# Altium project PrintingProjectAllDocs.PrjPCB (part 1 of 3)
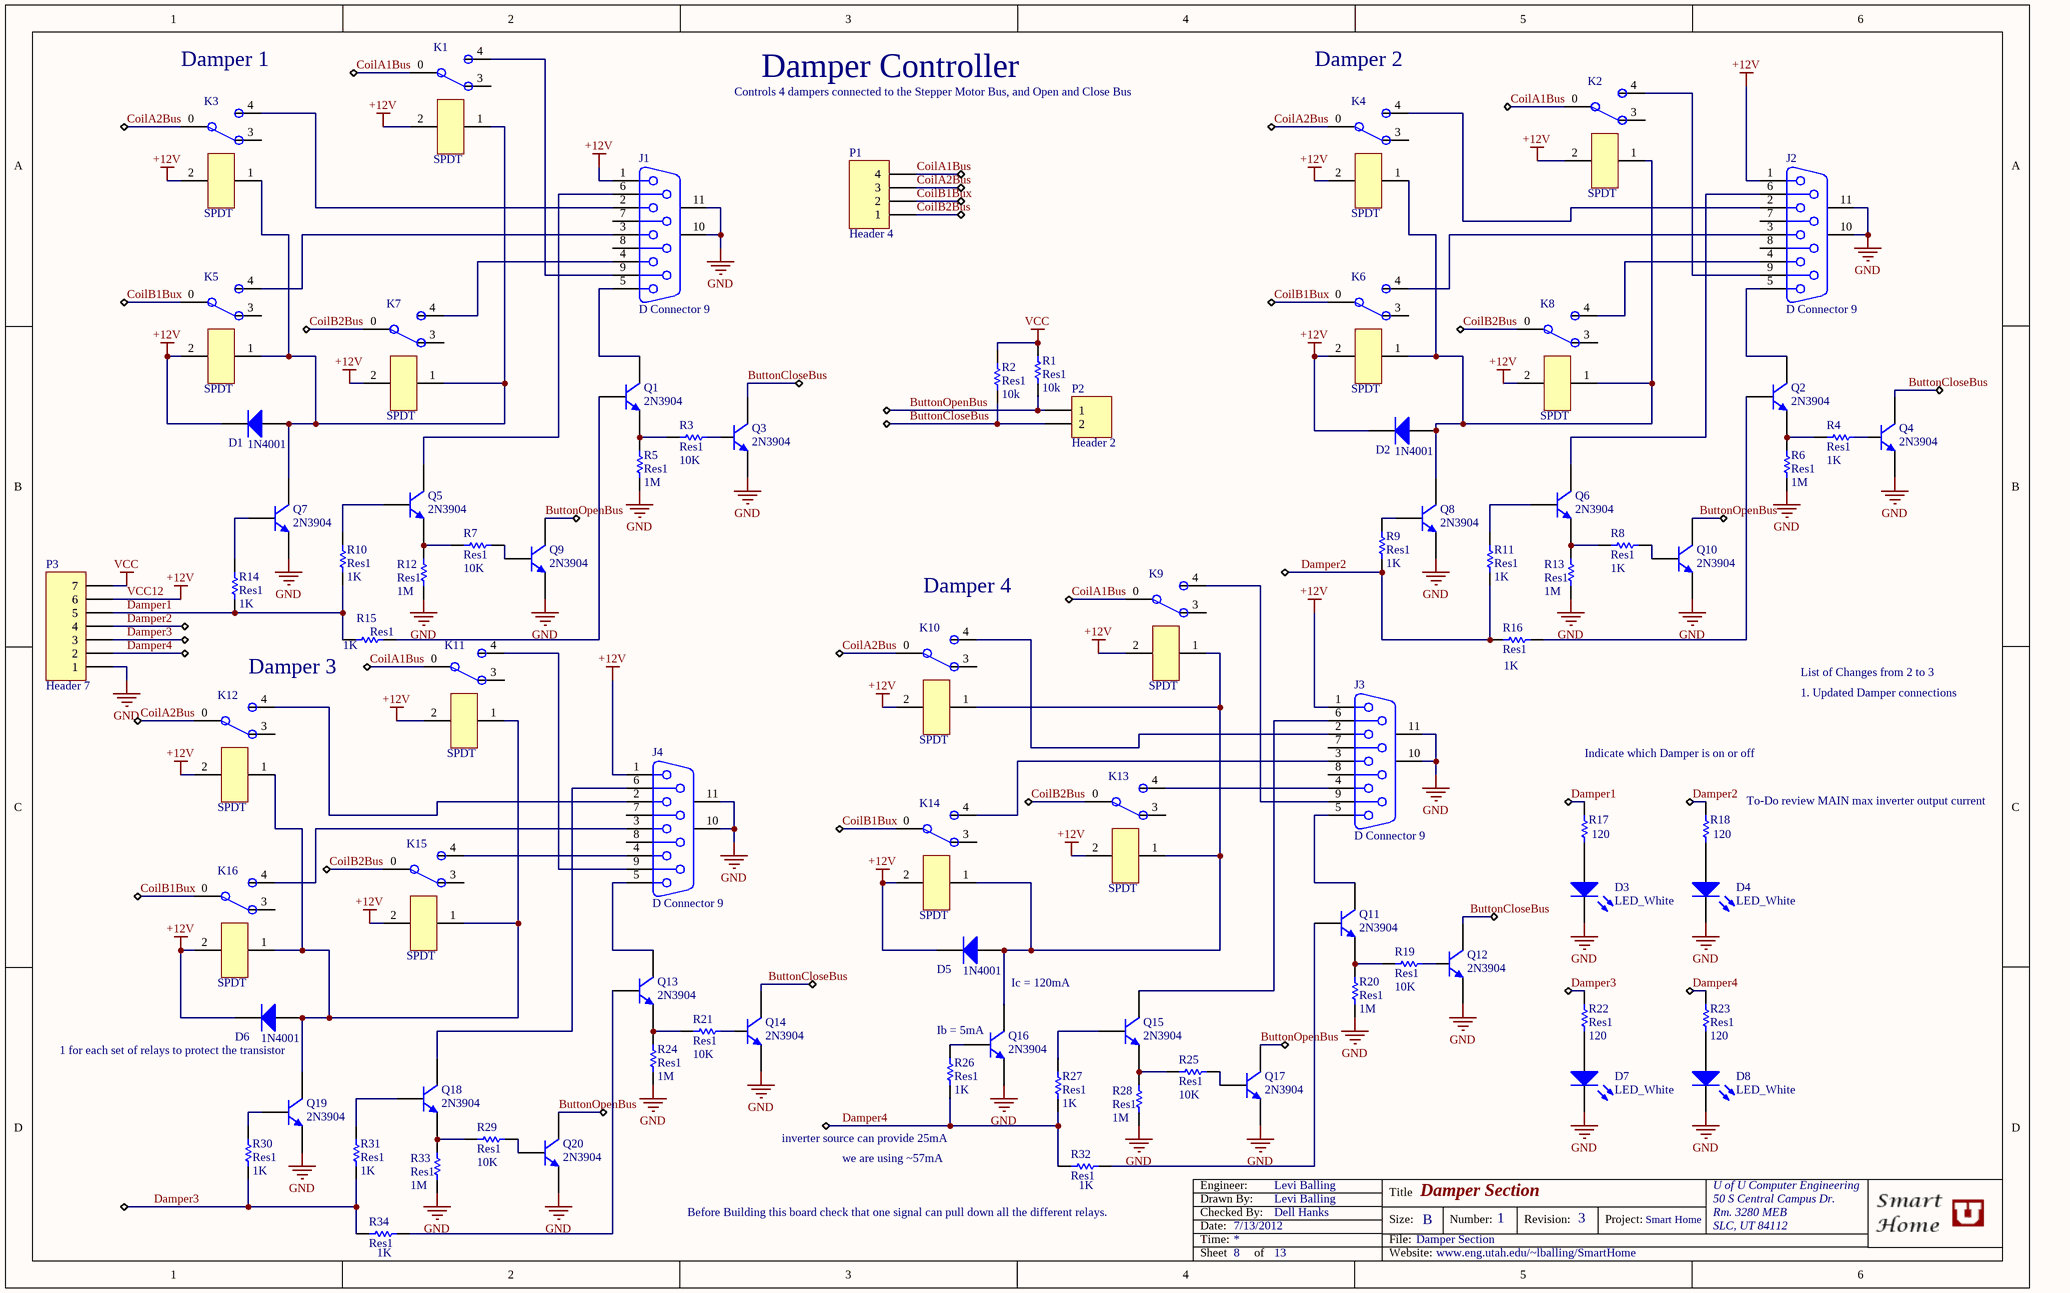
[diagram p0: DamperSection.SchDoc]
13 sheets, 669 parts. Net scope: global (net labels, ports and power ports of the same name join across sheets).
Board files: DamperSectionPCB.PcbDoc, HeatingAC_Garage.PcbDoc, HighPowerMotorController.PcbDoc, MainControllerPCB.PcbDoc, PowerBoard.PcbDoc, TemperatureSensorBlockPCB.PcbDoc, WirelessCommunications.PcbDoc, SpeakerMixerBoard.PcbDoc, SprinklerBoard.PcbDoc
Sheets:
  DamperSection.SchDoc
  EpicCubeDiagram.SchDoc
  EpicCubeDiagram2.SchDoc
  HeatingAC_Garage.SchDoc
  MainController.SchDoc
  MicMixer.SchDoc
  MotorController.SchDoc
  PowerAndFanBoard.SchDoc
  SpeakerMixer.SchDoc
  SprinklerBoard.SchDoc
  TemperatureSensorBlock.SchDoc
  TheEpicCube.SchDoc
  WirelessCommunications.SchDoc

## Sheet DamperSection.SchDoc: Damper Section
size B; Date: 7/13/2012; ApprovedBy: Levi Balling; CheckedBy: Dell Hanks; Author: Levi Balling; CompanyName: Smart Home; DrawnBy: Levi Balling; Engineer: Levi Balling; Organization: U of U Computer Engineering; Address1: 50 S Central Campus Dr.; Address2: Rm. 3280 MEB; Address3: SLC, UT 84112; DocumentNumber: 1; Revision: 3; SheetNumber: 8; SheetTotal: 13; Project: Smart Home; Website: www.eng.utah.edu/~lballing/SmartHome; CurrentDate: 7/13/2012; DocumentName: Damper Section; ProjectName: Smart Home

### Parts
(Parts that share a designator on the sheet are numbered #1, #2 ... from top to bottom, then left to right.)
D1#1  1N4001  [DO-41]
D2#1  1N4001  [DO-41]
D3#1  LED_White  [LED]
D4#1  LED_White  [LED]
D5#1  1N4001  [DO-41]
D6#1  1N4001  [DO-41]
D7#1  LED_White  [LED]
D8#1  LED_White  [LED]
J1#1  D Connector 9  [DSUB1.385-2H9]
J2#1  D Connector 9  [DSUB1.385-2H9]
J3#1  D Connector 9  [DSUB1.385-2H9]
J4#1  D Connector 9  [DSUB1.385-2H9]
K1#1  SPDT  [Relay - SPDT]
K2#1  SPDT  [Relay - SPDT]
K3#1  SPDT  [Relay - SPDT]
K4#1  SPDT  [Relay - SPDT]
K5#1  SPDT  [Relay - SPDT]
K6#1  SPDT  [Relay - SPDT]
K7#1  SPDT  [Relay - SPDT]
K8  SPDT  [Relay - SPDT]
K9  SPDT  [Relay - SPDT]
K10  SPDT  [Relay - SPDT]
K11  SPDT  [Relay - SPDT]
K12  SPDT  [Relay - SPDT]
K13  SPDT  [Relay - SPDT]
K14  SPDT  [Relay - SPDT]
K15  SPDT  [Relay - SPDT]
K16  SPDT  [Relay - SPDT]
P1#1  Header 4  [HDR1X4]
P2#1  Header 2  [HDR1X2]
P3#1  Header 7  [HDR1X7]
Q1#1  2N3904  [2N3904]
Q2#1  2N3904  [2N3904]
Q3#1  2N3904  [2N3904]
Q4#1  2N3904  [2N3904]
Q5#1  2N3904  [2N3904]
Q6#1  2N3904  [2N3904]
Q7#1  2N3904  [2N3904]
Q8#1  2N3904  [2N3904]
Q9#1  2N3904  [2N3904]
Q10#1  2N3904  [2N3904]
Q11  2N3904  [2N3904]
Q12  2N3904  [2N3904]
Q13  2N3904  [2N3904]
Q14  2N3904  [2N3904]
Q15  2N3904  [2N3904]
Q16  2N3904  [2N3904]
Q17  2N3904  [2N3904]
Q18  2N3904  [2N3904]
Q19  2N3904  [2N3904]
Q20  2N3904  [2N3904]
R1#1  Res1  value 10k  [AXIAL-0.3]
R2#1  Res1  value 10k  [AXIAL-0.3]
R3#1  Res1  value 10K  [AXIAL-0.3]
R4#1  Res1  value 1K  [AXIAL-0.3]
R5#1  Res1  value 1M  [AXIAL-0.3]
R6#1  Res1  value 1M  [AXIAL-0.3]
R7#1  Res1  value 10K  [AXIAL-0.3]
R8#1  Res1  value 1K  [AXIAL-0.3]
R9#1  Res1  value 1K  [AXIAL-0.3]
R10#1  Res1  value 1K  [AXIAL-0.3]
R11#1  Res1  value 1K  [AXIAL-0.3]
R12#1  Res1  value 1M  [AXIAL-0.3]
R13#1  Res1  value 1M  [AXIAL-0.3]
R14#1  Res1  value 1K  [AXIAL-0.3]
R15#1  Res1  value 1K  [AXIAL-0.3]
R16#1  Res1  value 1K  [AXIAL-0.3]
R17#1  value 120  [AXIAL-0.3]  (hidden comment: Res1)
R18#1  120  [AXIAL-0.3]
R19#1  Res1  value 10K  [AXIAL-0.3]
R20#1  Res1  value 1M  [AXIAL-0.3]
R21#1  Res1  value 10K  [AXIAL-0.3]
R22#1  Res1  value 120  [AXIAL-0.3]
R23#1  Res1  value 120  [AXIAL-0.3]
R24#1  Res1  value 1M  [AXIAL-0.3]
R25#1  Res1  value 10K  [AXIAL-0.3]
R26#1  Res1  value 1K  [AXIAL-0.3]
R27#1  Res1  value 1K  [AXIAL-0.3]
R28#1  Res1  value 1M  [AXIAL-0.3]
R29#1  Res1  value 10K  [AXIAL-0.3]
R30#1  Res1  value 1K  [AXIAL-0.3]
R31#1  Res1  value 1K  [AXIAL-0.3]
R32#1  Res1  value 1K  [AXIAL-0.3]
R33  Res1  value 1M  [AXIAL-0.3]
R34  Res1  value 1K  [AXIAL-0.3]

### Nets
GND: D3#1.2(K) D4#1.2(K) D7#1.2(K) D8#1.2(K) J1#1.10(MH1) J1#1.11(MH2) J2#1.10(MH1) J2#1.11(MH2) J3#1.10(MH1) J3#1.11(MH2) J4#1.10(MH1) J4#1.11(MH2) P3#1.1 Q3#1.1(E) Q4#1.1(E) Q7#1.1(E) Q8#1.1(E) Q9#1.1(E) Q10#1.1(E) Q12.1(E) Q14.1(E) Q16.1(E) Q17.1(E) Q19.1(E) Q20.1(E) R5#1.1 R6#1.1 R12#1.1 R13#1.1 R20#1.1 R24#1.1 R28#1.1 R33.1  [project net DampVCC12]
VCC: P3#1.7 R1#1.2 R2#1.2
VCC12: D1#1.2(K) D2#1.2(K) D5#1.2(K) D6#1.2(K) J1#1.1 J2#1.1 J3#1.1 J4#1.1 K1#1.2 K2#1.2 K3#1.2 K4#1.2 K5#1.2 K6#1.2 K7#1.2 K8.2 K9.2 K10.2 K11.2 K12.2 K13.2 K14.2 K15.2 K16.2 P3#1.6  [also labelled +12V]
ButtonCloseBus: P2#1.2 Q3#1.3(C) Q4#1.3(C) Q12.3(C) Q14.3(C) R2#1.1
ButtonOpenBus: P2#1.1 Q9#1.3(C) Q10#1.3(C) Q17.3(C) Q20.3(C) R1#1.1
CoilA1Bus: K1#1.0 K2#1.0 K9.0 K11.0 P1#1.4
CoilA2Bus: K3#1.0 K4#1.0 K10.0 K12.0 P1#1.3
CoilB1Bux: K5#1.0 K6#1.0 K14.0 K16.0 P1#1.2
CoilB2Bus: K7#1.0 K8.0 K13.0 K15.0 P1#1.1
Damper1: P3#1.5 R10#1.1 R14#1.1 R15#1.1 R17#1.1
Damper2: P3#1.4 R9#1.1 R11#1.1 R16#1.1 R18#1.1
Damper3: P3#1.3 R22#1.1 R30#1.1 R31#1.1 R34.1
Damper4: P3#1.2 R23#1.1 R26#1.1 R27#1.1 R32#1.1
NetD1#1_1: D1#1.1(A) K1#1.1 K3#1.1 K5#1.1 K7#1.1 Q7#1.3(C)
NetD2#1_1: D2#1.1(A) K2#1.1 K4#1.1 K6#1.1 K8.1 Q8#1.3(C)
NetD3#1_1: D3#1.1(A) R17#1.2
NetD4#1_1: D4#1.1(A) R18#1.2
NetD5#1_1: D5#1.1(A) K9.1 K10.1 K13.1 K14.1 Q16.3(C)
NetD6#1_1: D6#1.1(A) K11.1 K12.1 K15.1 K16.1 Q19.3(C)
NetD7#1_1: D7#1.1(A) R22#1.2
NetD8#1_1: D8#1.1(A) R23#1.2
NetJ1#1_2: J1#1.2 K3#1.4
NetJ1#1_3: J1#1.3 K5#1.4
NetJ1#1_4: J1#1.4 K7#1.4
NetJ1#1_5: J1#1.5 Q1#1.3(C)
NetJ1#1_6: J1#1.6 Q5#1.3(C)
NetJ1#1_9: J1#1.9 K1#1.4
NetJ2#1_2: J2#1.2 K4#1.4
NetJ2#1_3: J2#1.3 K6#1.4
NetJ2#1_4: J2#1.4 K8.4
NetJ2#1_5: J2#1.5 Q2#1.3(C)
NetJ2#1_6: J2#1.6 Q6#1.3(C)
NetJ2#1_9: J2#1.9 K2#1.4
NetJ3#1_2: J3#1.2 K10.4
NetJ3#1_3: J3#1.3 K14.4
NetJ3#1_4: J3#1.4 K13.4
NetJ3#1_5: J3#1.5 Q11.3(C)
NetJ3#1_6: J3#1.6 Q15.3(C)
NetJ3#1_9: J3#1.9 K9.4
NetJ4#1_2: J4#1.2 K12.4
NetJ4#1_3: J4#1.3 K16.4
NetJ4#1_4: J4#1.4 K15.4
NetJ4#1_5: J4#1.5 Q13.3(C)
NetJ4#1_6: J4#1.6 Q18.3(C)
NetJ4#1_9: J4#1.9 K11.4
NetQ1#1_1: Q1#1.1(E) R3#1.1 R5#1.2
NetQ1#1_2: Q1#1.2(B) R15#1.2
NetQ2#1_1: Q2#1.1(E) R4#1.1 R6#1.2
NetQ2#1_2: Q2#1.2(B) R16#1.2
NetQ3#1_2: Q3#1.2(B) R3#1.2
NetQ4#1_2: Q4#1.2(B) R4#1.2
NetQ5#1_1: Q5#1.1(E) R7#1.1 R12#1.2
NetQ5#1_2: Q5#1.2(B) R10#1.2
NetQ6#1_1: Q6#1.1(E) R8#1.1 R13#1.2
NetQ6#1_2: Q6#1.2(B) R11#1.2
NetQ7#1_2: Q7#1.2(B) R14#1.2
NetQ8#1_2: Q8#1.2(B) R9#1.2
NetQ9#1_2: Q9#1.2(B) R7#1.2
NetQ10#1_2: Q10#1.2(B) R8#1.2
NetQ11_1: Q11.1(E) R19#1.1 R20#1.2
NetQ11_2: Q11.2(B) R32#1.2
NetQ12_2: Q12.2(B) R19#1.2
NetQ13_1: Q13.1(E) R21#1.1 R24#1.2
NetQ13_2: Q13.2(B) R34.2
NetQ14_2: Q14.2(B) R21#1.2
NetQ15_1: Q15.1(E) R25#1.1 R28#1.2
NetQ15_2: Q15.2(B) R27#1.2
NetQ16_2: Q16.2(B) R26#1.2
NetQ17_2: Q17.2(B) R25#1.2
NetQ18_1: Q18.1(E) R29#1.1 R33.2
NetQ18_2: Q18.2(B) R31#1.2
NetQ19_2: Q19.2(B) R30#1.2
NetQ20_2: Q20.2(B) R29#1.2

Not connected (* = marked no-connect by the designer): J1#1 7 8; J2#1 7 8; J3#1 7 8; J4#1 7 8; K1#1 3; K2#1 3; K3#1 3; K4#1 3; K5#1 3; K6#1 3; K7#1 3; K8 3; K9 3; K10 3; K11 3; K12 3; K13 3; K14 3; K15 3; K16 3

### Notes on the sheet
- (near K3#1) Damper 1
- Controls 4 dampers connected to the Stepper Motor Bus, and Open and Close Bus
- Damper Controller
- (near K4#1) Damper 2
- (near K10) Damper 4
- Damper 3
- List of Changes from 2 to 3
- 1. Updated Damper connections
- Indicate which Damper is on or off
- (near R18#1) To-Do review MAIN max inverter output current
- (near Q16) Ib = 5mA
- Ic = 120mA
- 1 for each set of relays to protect the transistor
- (near R26#1) inverter source can provide 25mA
- we are using ~57mA
- (near R32#1) Before Building this board check that one signal can pull down all the different relays.
- Date:
- Time:
- Engineer:
- Drawn By:
- Checked By:
- Title
- Size:
- File:
- B
- Number:
- Revision:
- Project:
- Sheet
- of
- Website:

### Library data of the parts
D1#1 D2#1 D5#1 D6#1 = 1N4001: 1.0 Ampere General Purpose Rectifier; Vendor: Taydaelectronics; Published: 8-Jun-2000; LatestRevisionDate: 17-Jul-2002; LatestRevisionNote: Re-released for DXP Platform.; DatasheetDocument: 1998; PackageDocument: Aug-1999; PackageReference: DO-41; Publisher: Altium Limited; Code_JEDEC: DO-204-AL; ComponentLink1Description: Manufacturer Link; ComponentLink1URL: http://www.fairchildsemi.com/; ComponentLink2Description: Pinout Specification; ComponentLink2URL: http://www.fairchildsemi.com/ds/1N%2F1N4001.pdf; Price: 0.01; Value: 1N4001
D3#1 D4#1 D7#1 D8#1 = LED0: Typical INFRARED GaAs LED; Vendor: Taydaelectronics; Value: White_LED; Published: 8-Jun-2000; LatestRevisionDate: 08-Jul-2005; LatestRevisionNote: Mech Layer 1 removed.; PackageReference: LED-0; Publisher: Altium Limited; PackageDescription: LED; 2 Leads; Price: 0.04
J1#1 J2#1 J3#1 J4#1 = D Connector 9: Receptacle Assembly, 9 Position, Right Angle; PackageDocument: O; Positions: 9; Vendor: Taydaelectronics; Published: 15-Jun-2001; LatestRevisionDate: 17-Jul-2002; LatestRevisionNote: Re-released for DXP Platform.; DatasheetDocument: 1-Sep-1999; PackageReference: 788750; Publisher: Altium Limited; Orientation: Right Angle; Gender: Receptacle; Price: 0.48; Value: D Connector 9
K1#1 K2#1 K3#1 K4#1 K5#1 K6#1 K7#1 K8-K16 = SPDT: Vendor: Taydaelectronics; Coil Resistance: 400; Price: 0.64
P1#1 = Header 4: Header, 4-Pin; Vendor: Taydaelectronics; LatestRevisionDate: 17-Jul-2002; LatestRevisionNote: Re-released for DXP Platform.; Publisher: Altium Limited; Price: 0.04; Value: Header 4
P2#1 = Header 2: Header, 2-Pin; Vendor: Taydaelectronics; LatestRevisionDate: 17-Jul-2002; LatestRevisionNote: Re-released for DXP Platform.; Publisher: Altium Limited; Price: 0.02; Value: Header 2
P3#1 = Header 7: Header, 7-Pin; Vendor: Taydaelectronics; LatestRevisionDate: 17-Jul-2002; LatestRevisionNote: Re-released for DXP Platform.; Publisher: Altium Limited; Price: 0.07; Value: Header 7
Q1#1 Q2#1 Q3#1 Q4#1 Q5#1 Q6#1 Q7#1 Q8#1 Q9#1 Q10#1 Q11-Q20 = 2N3904: NPN General Purpose Amplifier; Vendor: Taydaelectronics; Published: 8-Jun-2000; LatestRevisionDate: 15-Jan-2003; LatestRevisionNote: PCB Footprint 'BCY-W3/D4.7' replaced; DatasheetVersion: 1997; PackageVersion: Sep-1998; PackageReference: TO-92A; Publisher: Altium Limited; PackageDescription: TO, Flat Index; 3 In-Line, Axial Leads; Body Dia. 4.5mm; Leads 0.51 x 0.48 mm (max); ComponentLink1URL: http://www.fairchildsemi.com/; ComponentLink2Description: Datasheet; ComponentLink2URL: http://www.fairchildsemi.com/ds/2N%2F2N3904.pdf; Price: 0.01; Value: 2N3904
R1#1 R2#1 R3#1 R4#1 R5#1 R6#1 R7#1 R8#1 R9#1 R10#1 R11#1 R12#1 R13#1 R14#1 R15#1 R16#1 R17#1 R18#1 R19#1 R20#1 R21#1 R22#1 R23#1 R24#1 R25#1 R26#1 R27#1 R28#1 R29#1 R30#1 R31#1 R32#1 R33 R34 = Res1: Resistor; Vendor: Taydaelectronics; Published: 8-Jun-2000; LatestRevisionDate: 17-Jul-2002; LatestRevisionNote: Re-released for DXP Platform.; PackageReference: AXIAL-0.3; Publisher: Altium Limited; PackageDescription: Axial Device, Thru-Hole; 2 Leads; 0.3 in Pin Spacing; Price: 0.01
  R18#1: Value: 120

## Sheet EpicCubeDiagram.SchDoc: Epic Cube Diagram
size B; CompanyName: Smart Home; DrawnBy: Levi Balling; Engineer: Levi Balling; Organization: U of U Computer Engineering; Address1: 50 S Central Campus Dr.; Address2: Rm. 3280 MEB; Address3: SLC, UT 84112; DocumentNumber: 1; Revision: 1; SheetNumber: 2; SheetTotal: 13; Project: Smart Home; Website: www.eng.utah.edu/~lballing/SmartHome
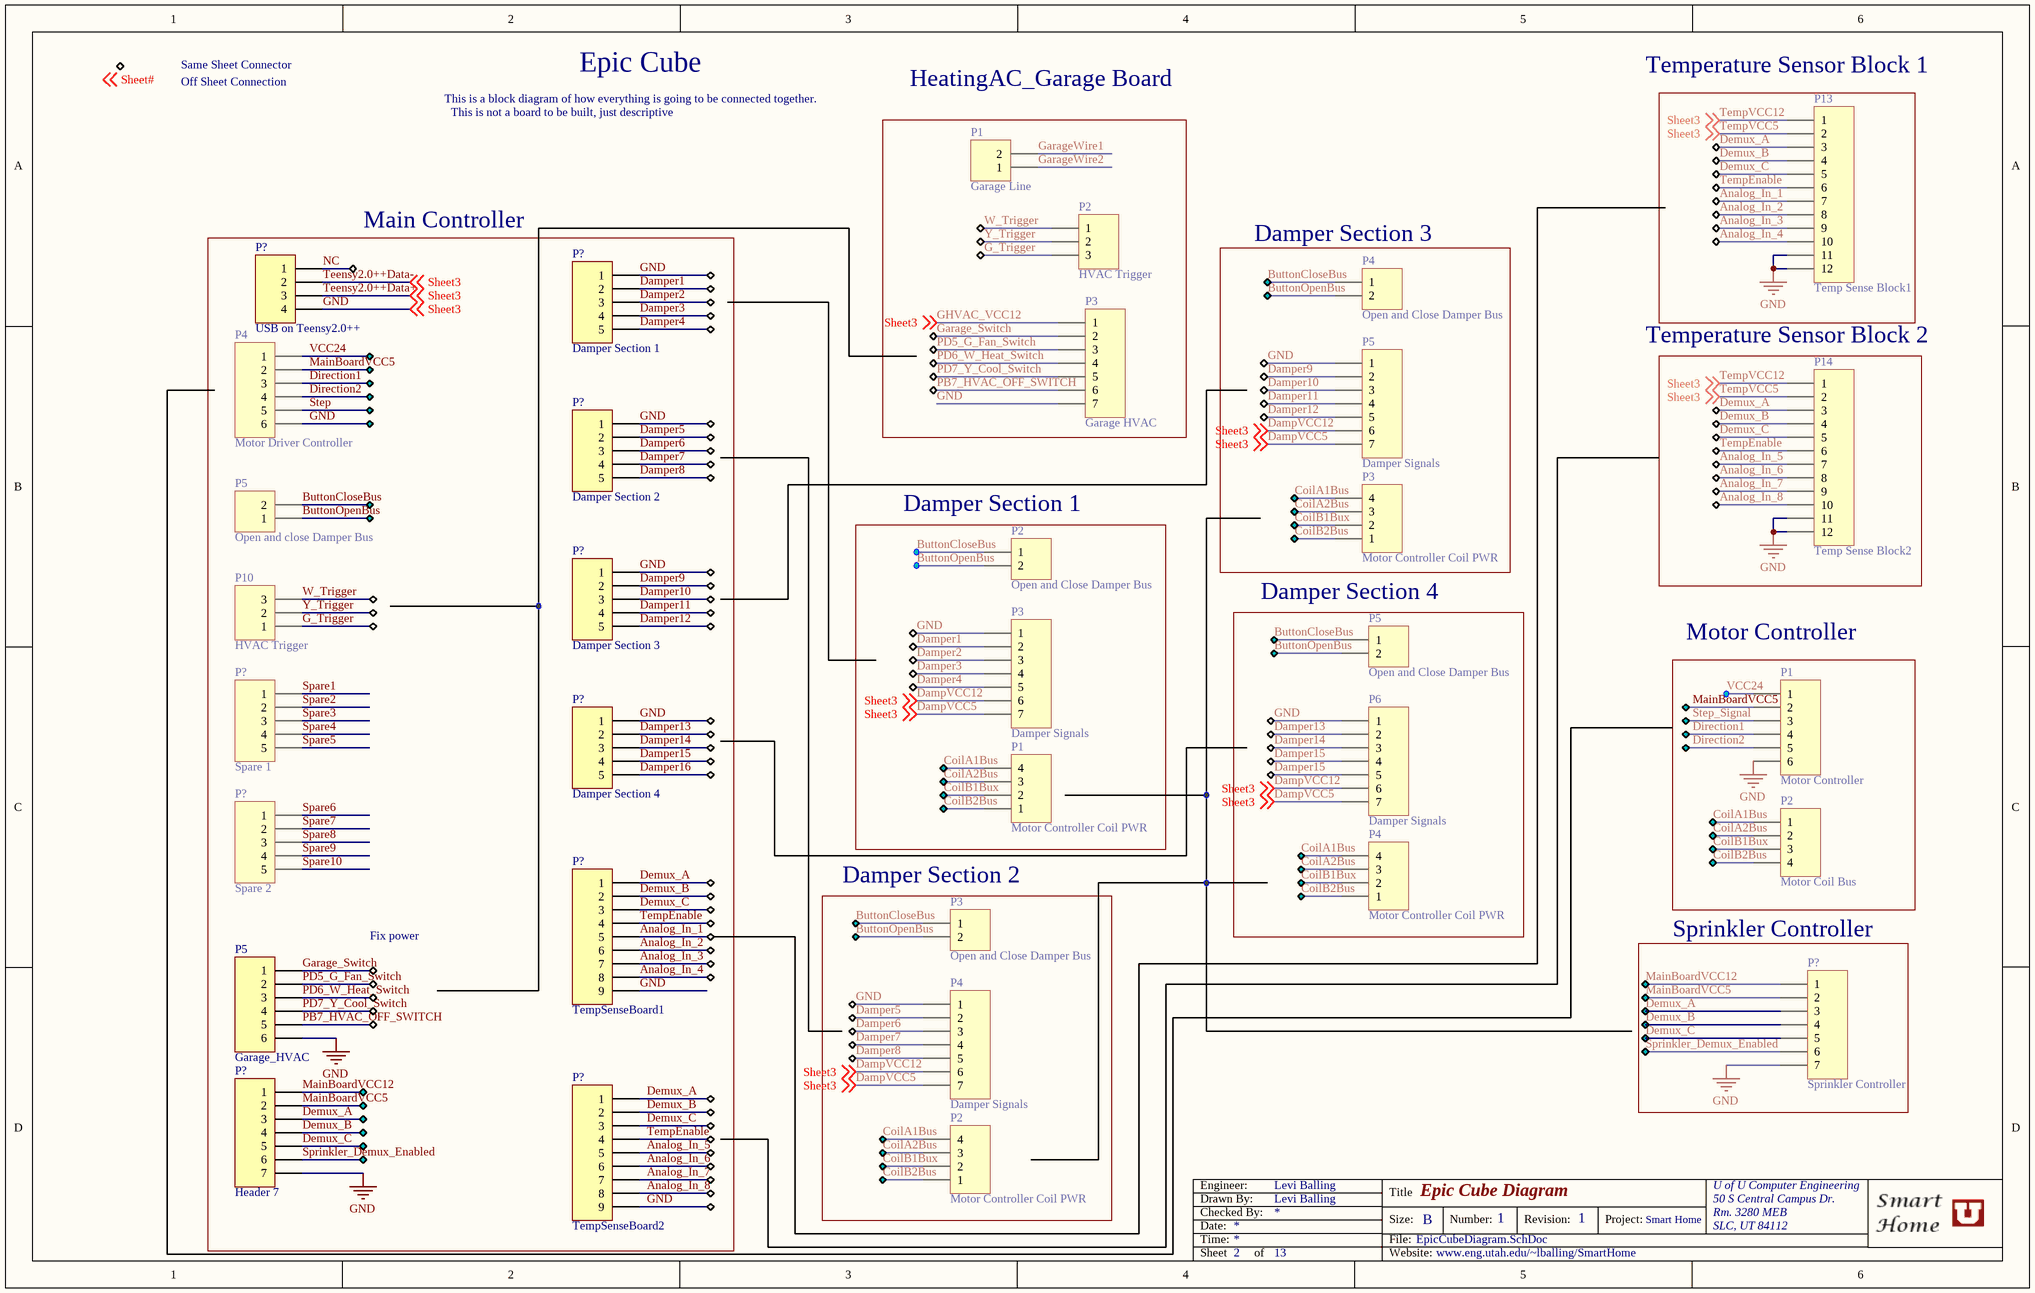
[diagram p1: EpicCubeDiagram.SchDoc]

### Parts
(Parts that share a designator on the sheet are numbered #1, #2 ... from top to bottom, then left to right.)
P1#2  Garage Line  [HDR1X2]
P1#3  Motor Controller  [HDR1X6]
P1#4  Motor Controller Coil PWR  [HDR1X4]
P2#2  HVAC Trigger  [HDR1X3]
P2#3  Open and Close Damper Bus  [HDR1X2]
P2#4  Motor Coil Bus  [HDR1X4]
P2#5  Motor Controller Coil PWR  [HDR1X4]
P3#2  Garage HVAC  [HDR1X7]
P3#3  Motor Controller Coil PWR  [HDR1X4]
P3#4  Damper Signals  [HDR1X7]
P3#5  Open and Close Damper Bus  [HDR1X2]
P4#1  Open and Close Damper Bus  [HDR1X2]
P4#2  Motor Driver Controller  [HDR1X6]
P4#3  Motor Controller Coil PWR  [HDR1X4]
P4#4  Damper Signals  [HDR1X7]
P5#1  Damper Signals  [HDR1X7]
P5#2  Open and close Damper Bus  [HDR1X2]
P5#3  Open and Close Damper Bus  [HDR1X2]
P5#4  Garage_HVAC  [HDR1X6]
P6#1  Damper Signals  [HDR1X7]
P10#1  HVAC Trigger  [HDR1X3]
P13#1  Temp Sense Block1  [HDR1X12]
P14#1  Temp Sense Block2  [HDR1X12]
P?#1  USB on Teensy2.0++  [HDR1X4]
P?#2  Damper Section 1  [HDR1X5]
P?#3  Damper Section 2  [HDR1X5]
P?#4  Damper Section 3  [HDR1X5]
P?#5  Spare 1  [HDR1X5]
P?#6  Damper Section 4  [HDR1X5]
P?#7  Spare 2  [HDR1X5]
P?#8  TempSenseBoard1  [HDR1X9]
P?#9  Sprinkler Controller  [HDR1X7]
P?#10  Header 7  [HDR1X7]
P?#11  TempSenseBoard2  [HDR1X9]

### Blocks framed on the sheet
Main Controller: P4#2 P5#2 P5#4 P10#1 P?#1-P?#8 P?#10 P?#11
Damper Section 3: P3#3 P4#1 P5#1
Damper Section 1: P1#4 P2#3 P3#4
Damper Section 4: P4#3 P5#3 P6#1
Motor Controller: P1#3 P2#4
Damper Section 2: P2#5 P3#5 P4#4
Sprinkler Controller: P?#9

### Nets
DampVCC12: P1#3.6 P3#2.1 P3#2.7 P3#4.1 P3#4.6 P3#4.7 P4#2.6 P4#4.1 P4#4.6 P4#4.7 P5#1.1 P5#1.6 P5#1.7 P5#4.6 P6#1.1 P6#1.6 P6#1.7 P13#1.1 P13#1.2 P13#1.11 P13#1.12 P14#1.1 P14#1.2 P14#1.11 P14#1.12 P?#1.2 P?#1.3 P?#1.4 P?#2.1 P?#3.1 P?#4.1 P?#6.1 P?#8.9 P?#9.7 P?#10.7 P?#11.9 ; off-sheet Sheet3  [also labelled DampVCC5, GHVAC_VCC12, GND, Sheet3, Teensy2.0++Data+, Teensy2.0++Data-, TempVCC12, TempVCC5]
Analog_In_1: P13#1.7 P?#8.5
Analog_In_2: P13#1.8 P?#8.6
Analog_In_3: P13#1.9 P?#8.7
Analog_In_4: P13#1.10 P?#8.8
Analog_In_5: P14#1.7 P?#11.5
Analog_In_6: P14#1.8 P?#11.6
Analog_In_7: P14#1.9 P?#11.7
Analog_In_8: P14#1.10 P?#11.8
ButtonCloseBus: P2#3.1 P3#5.1 P4#1.1 P5#2.2 P5#3.1
ButtonOpenBus: P2#3.2 P3#5.2 P4#1.2 P5#2.1 P5#3.2
CoilA1Bus: P1#4.4 P2#4.1 P2#5.4 P3#3.4 P4#3.4
CoilA2Bus: P1#4.3 P2#4.2 P2#5.3 P3#3.3 P4#3.3
CoilB1Bux: P1#4.2 P2#4.3 P2#5.2 P3#3.2 P4#3.2
CoilB2Bus: P1#4.1 P2#4.4 P2#5.1 P3#3.1 P4#3.1
Damper1: P3#4.2 P?#2.2
Damper2: P3#4.3 P?#2.3
Damper3: P3#4.4 P?#2.4
Damper4: P3#4.5 P?#2.5
Damper5: P4#4.2 P?#3.2
Damper6: P4#4.3 P?#3.3
Damper7: P4#4.4 P?#3.4
Damper8: P4#4.5 P?#3.5
Damper9: P5#1.2 P?#4.2
Damper10: P5#1.3 P?#4.3
Damper11: P5#1.4 P?#4.4
Damper12: P5#1.5 P?#4.5
Damper13: P6#1.2 P?#6.2
Damper14: P6#1.3 P?#6.3
Damper15: P6#1.4 P6#1.5 P?#6.4
Damper16: P?#6.5
Demux_A: P13#1.3 P14#1.3 P?#8.1 P?#9.3 P?#10.3 P?#11.1
Demux_B: P13#1.4 P14#1.4 P?#8.2 P?#9.4 P?#10.4 P?#11.2
Demux_C: P13#1.5 P14#1.5 P?#8.3 P?#9.5 P?#10.5 P?#11.3
Direction1: P1#3.4 P4#2.3
Direction2: P1#3.5 P4#2.4
G_Trigger: P2#2.3 P10#1.1
Garage_Switch: P3#2.2 P5#4.1
GarageWire1: P1#2.2
GarageWire2: P1#2.1
MainBoardVCC5: P1#3.2 P4#2.2 P?#9.2 P?#10.2
MainBoardVCC12: P?#9.1 P?#10.1
NC: P?#1.1
PB7_HVAC_OFF_SWITCH: P3#2.6 P5#4.5
PD5_G_Fan_Switch: P3#2.3 P5#4.2
PD6_W_Heat_Switch: P3#2.4 P5#4.3
PD7_Y_Cool_Switch: P3#2.5 P5#4.4
Spare1: P?#5.1
Spare2: P?#5.2
Spare3: P?#5.3
Spare4: P?#5.4
Spare5: P?#5.5
Spare6: P?#7.1
Spare7: P?#7.2
Spare8: P?#7.3
Spare9: P?#7.4
Spare10: P?#7.5
Sprinkler_Demux_Enabled: P?#9.6 P?#10.6
Step: P4#2.5
Step_Signal: P1#3.3
TempEnable: P13#1.6 P14#1.6 P?#8.4 P?#11.4
VCC24: P1#3.1 P4#2.1
W_Trigger: P2#2.1 P10#1.3
Y_Trigger: P2#2.2 P10#1.2

### Notes on the sheet
- Same Sheet Connector
- Off Sheet Connection
- This is a block diagram of how everything is going to be connected together.
- Epic Cube
- HeatingAC_Garage Board
- (near P13#1) Temperature Sensor Block 1
- This is not a board to be built, just descriptive
- Temperature Sensor Block 2
- Fix power
- Labels drawn without touching a wire or pin: Sheet#
- Date:
- Time:
- Engineer:
- Drawn By:
- Checked By:
- Title
- Size:
- File:
- B
- Number:
- Revision:
- Project:
- Sheet
- of
- Website:

### Library data of the parts
P1#2 P2#3 P3#5 P4#1 P5#2 P5#3 = Header 2: Header, 2-Pin; Vendor: Taydaelectronics; LatestRevisionDate: 17-Jul-2002; LatestRevisionNote: Re-released for DXP Platform.; Publisher: Altium Limited; Price: 0.02; Value: Header 2
P1#3 P4#2 P5#4 = Header 6: Header, 6-Pin; Vendor: Taydaelectronics; LatestRevisionDate: 17-Jul-2002; LatestRevisionNote: Re-released for DXP Platform.; Publisher: Altium Limited; Price: 0.06; Value: Header 6
P1#4 P2#4 P2#5 P3#3 P4#3 P?#1 = Header 4: Header, 4-Pin; Vendor: Taydaelectronics; LatestRevisionDate: 17-Jul-2002; LatestRevisionNote: Re-released for DXP Platform.; Publisher: Altium Limited; Price: 0.04; Value: Header 4
P2#2 = Header 3: Header, 3-Pin; Vendor: Taydaelectronics; LatestRevisionDate: 17-Jul-2002; LatestRevisionNote: Re-released for DXP Platform.; Publisher: Altium Limited; Price: 0.03; Value: Header 3
P3#2 P3#4 P4#4 P5#1 P6#1 P?#9 P?#10 = Header 7: Header, 7-Pin; Vendor: Taydaelectronics; LatestRevisionDate: 17-Jul-2002; LatestRevisionNote: Re-released for DXP Platform.; Publisher: Altium Limited; Price: 0.07; Value: Header 7
P10#1 = Header 3: Header, 3-Pin; Vendor: Taydaelectronics; Value: Header 2; LatestRevisionDate: 17-Jul-2002; LatestRevisionNote: Re-released for DXP Platform.; Publisher: Altium Limited; Price: 0.03
P13#1 P14#1 = Header 12: Header, 12-Pin; Vendor: Taydaelectronics; LatestRevisionDate: 17-Jul-2002; LatestRevisionNote: Re-released for DXP Platform.; Publisher: Altium Limited; Price: 0.12; Value: Header 12
P?#2-P?#7 = Header 5: Header, 5-Pin; Vendor: Taydaelectronics; LatestRevisionDate: 17-Jul-2002; LatestRevisionNote: Re-released for DXP Platform.; Publisher: Altium Limited; Price: 0.05; Value: Header 5
P?#8 P?#11 = Header 9: Header, 9-Pin; Vendor: Taydaelectronics; LatestRevisionDate: 17-Jul-2002; LatestRevisionNote: Re-released for DXP Platform.; Publisher: Altium Limited; Price: 0.09; Value: Header 9

## Sheet EpicCubeDiagram2.SchDoc: Epic Cube Diagram
size B; CompanyName: Smart Home; DrawnBy: Levi Balling; Engineer: Levi Balling; Organization: U of U Computer Engineering; Address1: 50 S Central Campus Dr.; Address2: Rm. 3280 MEB; Address3: SLC, UT 84112; DocumentNumber: 1; Revision: 1; SheetNumber: 3; SheetTotal: 13; Project: Smart Home; Website: www.eng.utah.edu/~lballing/SmartHome
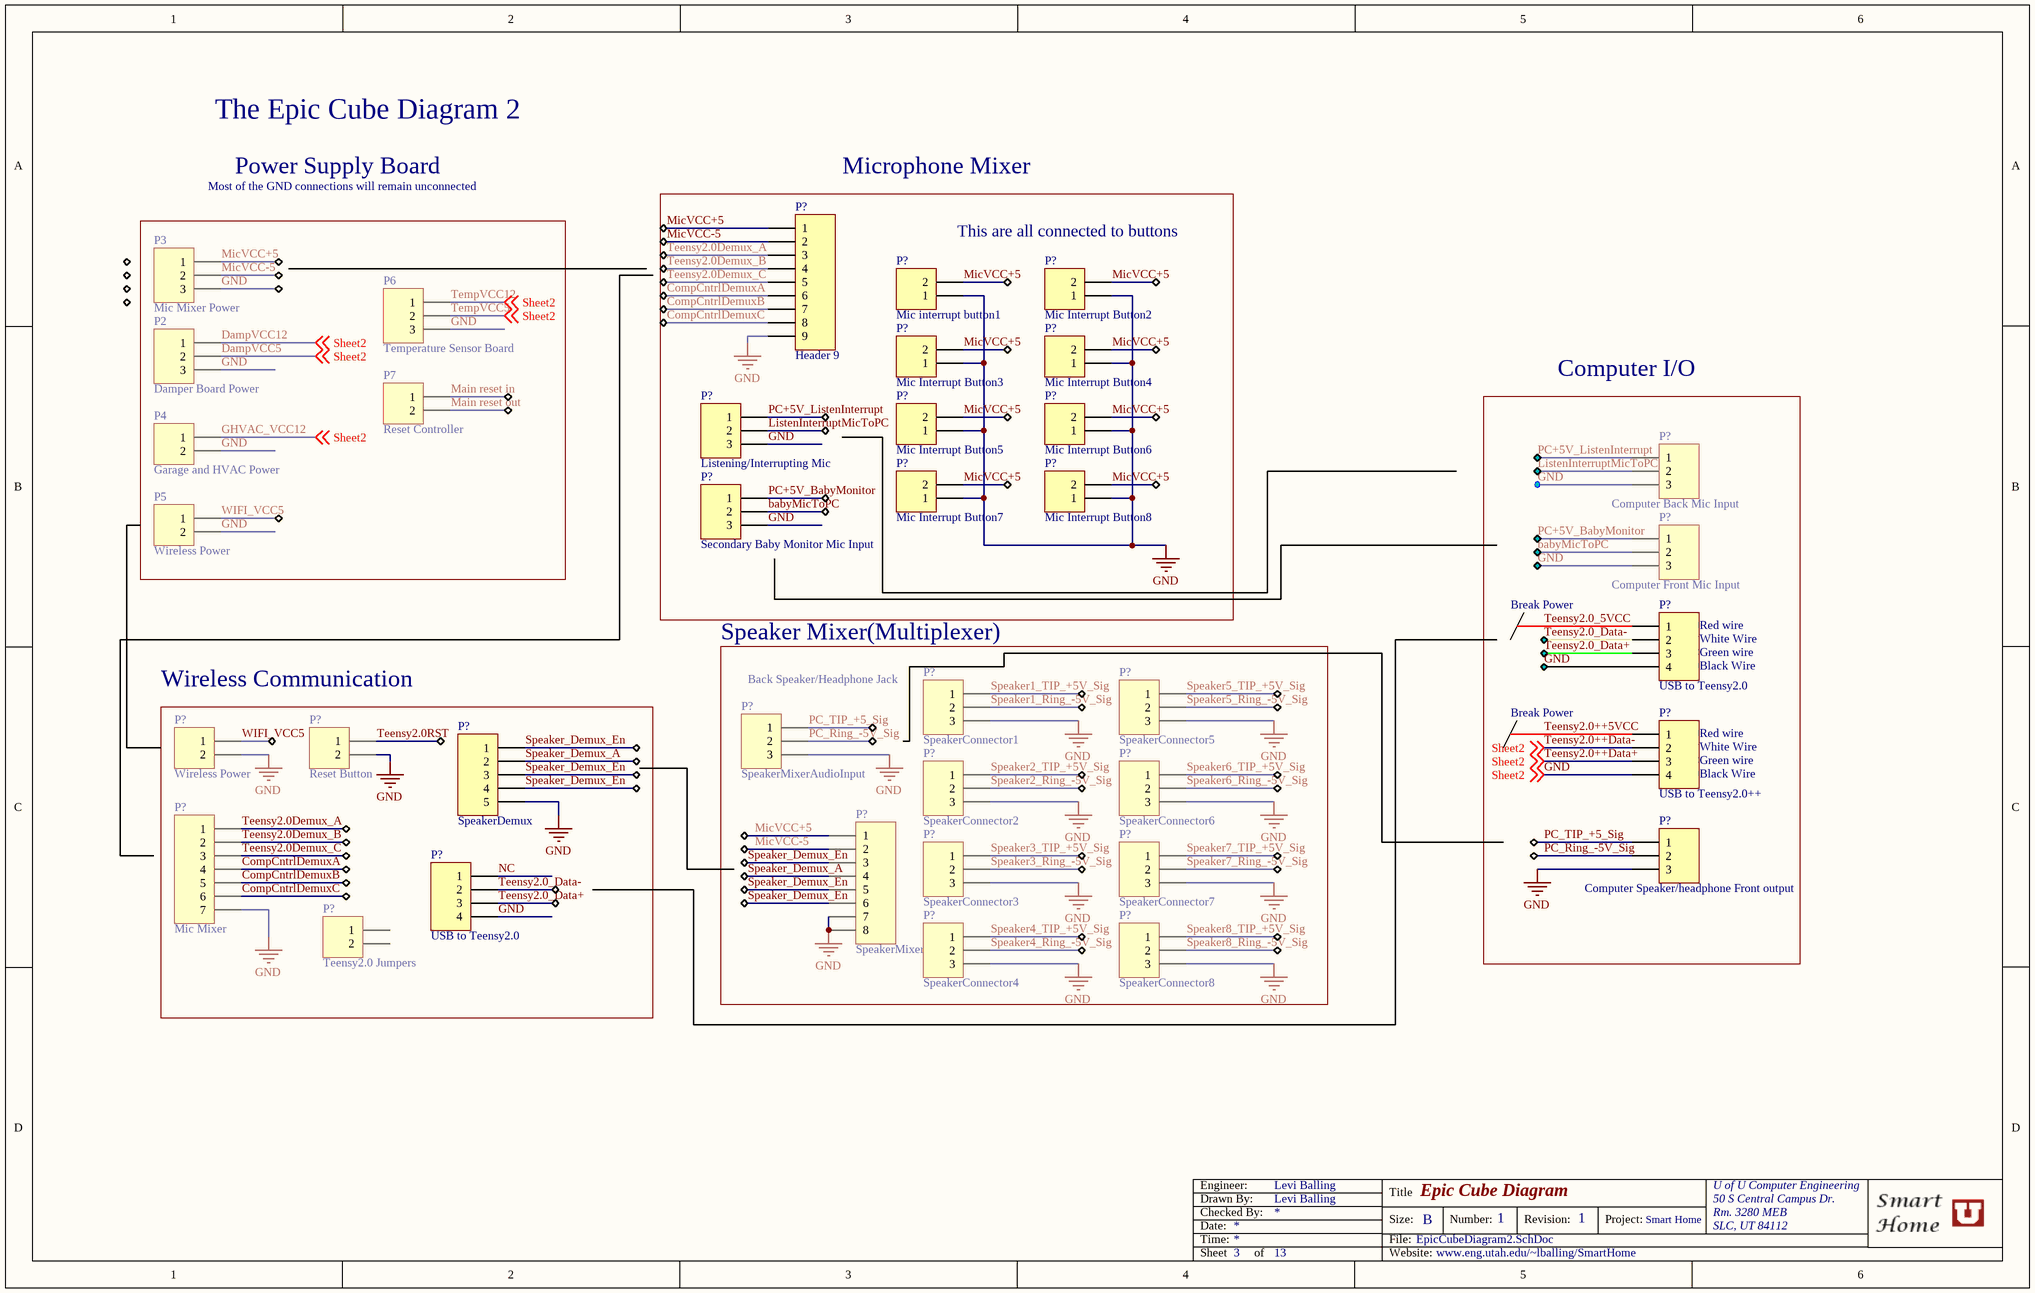
[diagram p2: EpicCubeDiagram2.SchDoc]

### Parts
(Parts that share a designator on the sheet are numbered #1, #2 ... from top to bottom, then left to right.)
P2#6  Damper Board Power  [HDR1X3]
P3#6  Mic Mixer Power  [HDR1X3]
P4#5  Garage and HVAC Power  [HDR1X2]
P5#5  Wireless Power  [HDR1X2]
P6#2  Temperature Sensor Board  [HDR1X3]
P7#1  Reset Controller  [HDR1X2]
P?#12  Header 9  [HDR1X9]
P?#13  Mic interrupt button1  [HDR1X2]
P?#14  Mic Interrupt Button2  [HDR1X2]
P?#15  Mic Interrupt Button3  [HDR1X2]
P?#16  Mic Interrupt Button4  [HDR1X2]
P?#17  Listening/Interrupting Mic  [HDR1X3]
P?#18  Mic Interrupt Button5  [HDR1X2]
P?#19  Mic Interrupt Button6  [HDR1X2]
P?#20  Computer Back Mic Input  [HDR1X3]
P?#21  Secondary Baby Monitor Mic Input  [HDR1X3]
P?#22  Mic Interrupt Button7  [HDR1X2]
P?#23  Mic Interrupt Button8  [HDR1X2]
P?#24  Computer Front Mic Input  [HDR1X3]
P?#25  USB to Teensy2.0  [HDR1X4]
P?#26  SpeakerConnector1  [HDR1X3]
P?#27  SpeakerConnector5  [HDR1X3]
P?#28  SpeakerMixerAudioInput  [HDR1X3]
P?#29  USB to Teensy2.0++  [HDR1X4]
P?#30  Wireless Power  [HDR1X2]
P?#31  Reset Button  [HDR1X2]
P?#32  SpeakerDemux  [HDR1X5]
P?#33  SpeakerConnector2  [HDR1X3]
P?#34  SpeakerConnector6  [HDR1X3]
P?#35  Mic Mixer  [HDR1X7]
P?#36  SpeakerMixer  [HDR1X8]
P?#37  Computer Speaker/headphone Front output  [HDR1X3]
P?#38  SpeakerConnector3  [HDR1X3]
P?#39  SpeakerConnector7  [HDR1X3]
P?#40  USB to Teensy2.0  [HDR1X4]
P?#41  Teensy2.0 Jumpers  [HDR1X2]
P?#42  SpeakerConnector4  [HDR1X3]
P?#43  SpeakerConnector8  [HDR1X3]

### Blocks framed on the sheet
Microphone Mixer: P?#12-P?#19 P?#21-P?#23
Computer I/O: P?#20 P?#24 P?#25 P?#29 P?#37
Speaker Mixer(Multiplexer): P?#26-P?#28 P?#33 P?#34 P?#36 P?#38 P?#39 P?#42 P?#43
Wireless Communication: P?#30-P?#32 P?#35 P?#40 P?#41

### Nets
DampVCC12: P2#6.1 P2#6.2 P2#6.3 P3#6.3 P4#5.1 P4#5.2 P5#5.2 P6#2.1 P6#2.2 P6#2.3 P?#12.9 P?#13.1 P?#14.1 P?#15.1 P?#16.1 P?#17.3 P?#18.1 P?#19.1 P?#20.3 P?#21.3 P?#22.1 P?#23.1 P?#24.3 P?#25.4 P?#26.3 P?#27.3 P?#28.3 P?#29.2 P?#29.3 P?#29.4 P?#30.2 P?#31.2 P?#32.5 P?#33.3 P?#34.3 P?#35.7 P?#36.7 P?#36.8 P?#37.3 P?#38.3 P?#39.3 P?#40.4 P?#42.3 P?#43.3 ; off-sheet Sheet2  [also labelled DampVCC5, GHVAC_VCC12, GND, Sheet2, Teensy2.0++Data+, Teensy2.0++Data-, TempVCC12, TempVCC5]
babyMicToPC: P?#21.2 P?#24.2
CompCntrlDemuxA: P?#12.6 P?#35.4
CompCntrlDemuxB: P?#12.7 P?#35.5
CompCntrlDemuxC: P?#12.8 P?#35.6
ListenInterruptMicToPC: P?#17.2 P?#20.2
Main reset in: P7#1.1
Main reset out: P7#1.2
MicVCC+5: P3#6.1 P?#12.1 P?#13.2 P?#14.2 P?#15.2 P?#16.2 P?#18.2 P?#19.2 P?#22.2 P?#23.2 P?#36.1
MicVCC-5: P3#6.2 P?#12.2 P?#36.2
NC: P?#40.1
PC+5V_BabyMonitor: P?#21.1 P?#24.1
PC+5V_ListenInterrupt: P?#17.1 P?#20.1
PC_Ring_-5V_Sig: P?#28.2 P?#37.2
PC_TIP_+5_Sig: P?#28.1 P?#37.1
Speaker1_Ring_-5V_Sig: P?#26.2
Speaker1_TIP_+5V_Sig: P?#26.1
Speaker2_Ring_-5V_Sig: P?#33.2
Speaker2_TIP_+5V_Sig: P?#33.1
Speaker3_Ring_-5V_Sig: P?#38.2
Speaker3_TIP_+5V_Sig: P?#38.1
Speaker4_Ring_-5V_Sig: P?#42.2
Speaker4_TIP_+5V_Sig: P?#42.1
Speaker5_Ring_-5V_Sig: P?#27.2
Speaker5_TIP_+5V_Sig: P?#27.1
Speaker6_Ring_-5V_Sig: P?#34.2
Speaker6_TIP_+5V_Sig: P?#34.1
Speaker7_Ring_-5V_Sig: P?#39.2
Speaker7_TIP_+5V_Sig: P?#39.1
Speaker8_Ring_-5V_Sig: P?#43.2
Speaker8_TIP_+5V_Sig: P?#43.1
Speaker_Demux_A: P?#32.2 P?#36.4
Speaker_Demux_En: P?#32.1 P?#32.3 P?#32.4 P?#36.3 P?#36.5 P?#36.6
Teensy2.0++5VCC: P?#29.1
Teensy2.0_5VCC: P?#25.1
Teensy2.0_Data+: P?#25.3 P?#40.3
Teensy2.0_Data-: P?#25.2 P?#40.2
Teensy2.0Demux_A: P?#12.3 P?#35.1
Teensy2.0Demux_B: P?#12.4 P?#35.2
Teensy2.0Demux_C: P?#12.5 P?#35.3
Teensy2.0RST: P?#31.1
WIFI_VCC5: P5#5.1 P?#30.1

Not connected (* = marked no-connect by the designer): P?#41 1 2

### Notes on the sheet
- The Epic Cube Diagram 2
- Most of the GND connections will remain unconnected
- Power Supply Board
- (near P?#14) This are all connected to buttons
- Break Power
- (near P?#25) Red wire
- (near P?#25) White Wire
- (near P?#28) Back Speaker/Headphone Jack
- (near P?#25) Green wire
- (near P?#25) Black Wire
- (near P?#29) Red wire
- (near P?#29) White Wire
- (near P?#29) Green wire
- (near P?#29) Black Wire
- Date:
- Time:
- Engineer:
- Drawn By:
- Checked By:
- Title
- Size:
- File:
- B
- Number:
- Revision:
- Project:
- Sheet
- of
- Website:

### Library data of the parts
P2#6 P3#6 P6#2 P?#17 P?#20 P?#21 P?#24 P?#26-P?#28 P?#33 P?#34 P?#37-P?#39 P?#42 P?#43 = Header 3: Header, 3-Pin; Vendor: Taydaelectronics; LatestRevisionDate: 17-Jul-2002; LatestRevisionNote: Re-released for DXP Platform.; Publisher: Altium Limited; Price: 0.03; Value: Header 3
P4#5 P5#5 P7#1 P?#13-P?#16 P?#18 P?#19 P?#22 P?#23 P?#30 P?#31 P?#41 = Header 2: Header, 2-Pin; Vendor: Taydaelectronics; LatestRevisionDate: 17-Jul-2002; LatestRevisionNote: Re-released for DXP Platform.; Publisher: Altium Limited; Price: 0.02; Value: Header 2
P?#12 = Header 9: Header, 9-Pin; Vendor: Taydaelectronics; LatestRevisionDate: 17-Jul-2002; LatestRevisionNote: Re-released for DXP Platform.; Publisher: Altium Limited; Price: 0.09; Value: Header 9
P?#25 P?#29 P?#40 = Header 4: Header, 4-Pin; Vendor: Taydaelectronics; LatestRevisionDate: 17-Jul-2002; LatestRevisionNote: Re-released for DXP Platform.; Publisher: Altium Limited; Price: 0.04; Value: Header 4
P?#32 = Header 5: Header, 5-Pin; Vendor: Taydaelectronics; LatestRevisionDate: 17-Jul-2002; LatestRevisionNote: Re-released for DXP Platform.; Publisher: Altium Limited; Price: 0.05; Value: Header 5
P?#35 = Header 7: Header, 7-Pin; Vendor: Taydaelectronics; LatestRevisionDate: 17-Jul-2002; LatestRevisionNote: Re-released for DXP Platform.; Publisher: Altium Limited; Price: 0.07; Value: Header 7
P?#36 = Header 8: Header, 8-Pin; Vendor: Taydaelectronics; LatestRevisionDate: 17-Jul-2002; LatestRevisionNote: Re-released for DXP Platform.; Publisher: Altium Limited; Price: 0.08; Value: Header 8

## Sheet HeatingAC_Garage.SchDoc: HVAC & Garage Control
size B; Date: 7/11/2012; CheckedBy: Dell Hanks; Author: Levi Balling; CompanyName: Smart House; DrawnBy: Levi Balling; Engineer: Levi Balling; Organization: U of U Computer Engineering; Address1: 50 S Central Campus Dr.; Address2: Rm. 3280 MEB; Address3: SLC, UT 84112; DocumentNumber: 1; Revision: 4; SheetNumber: 6; SheetTotal: 13; VersionControl_RevNumber: 1; Project: Smart Home; Website: www.eng.utah.edu/~lballing/SmartHome; DocumentName: HVAC & Garage Control; ModifiedDate: 7/11/2012; ProjectName: Smart Home
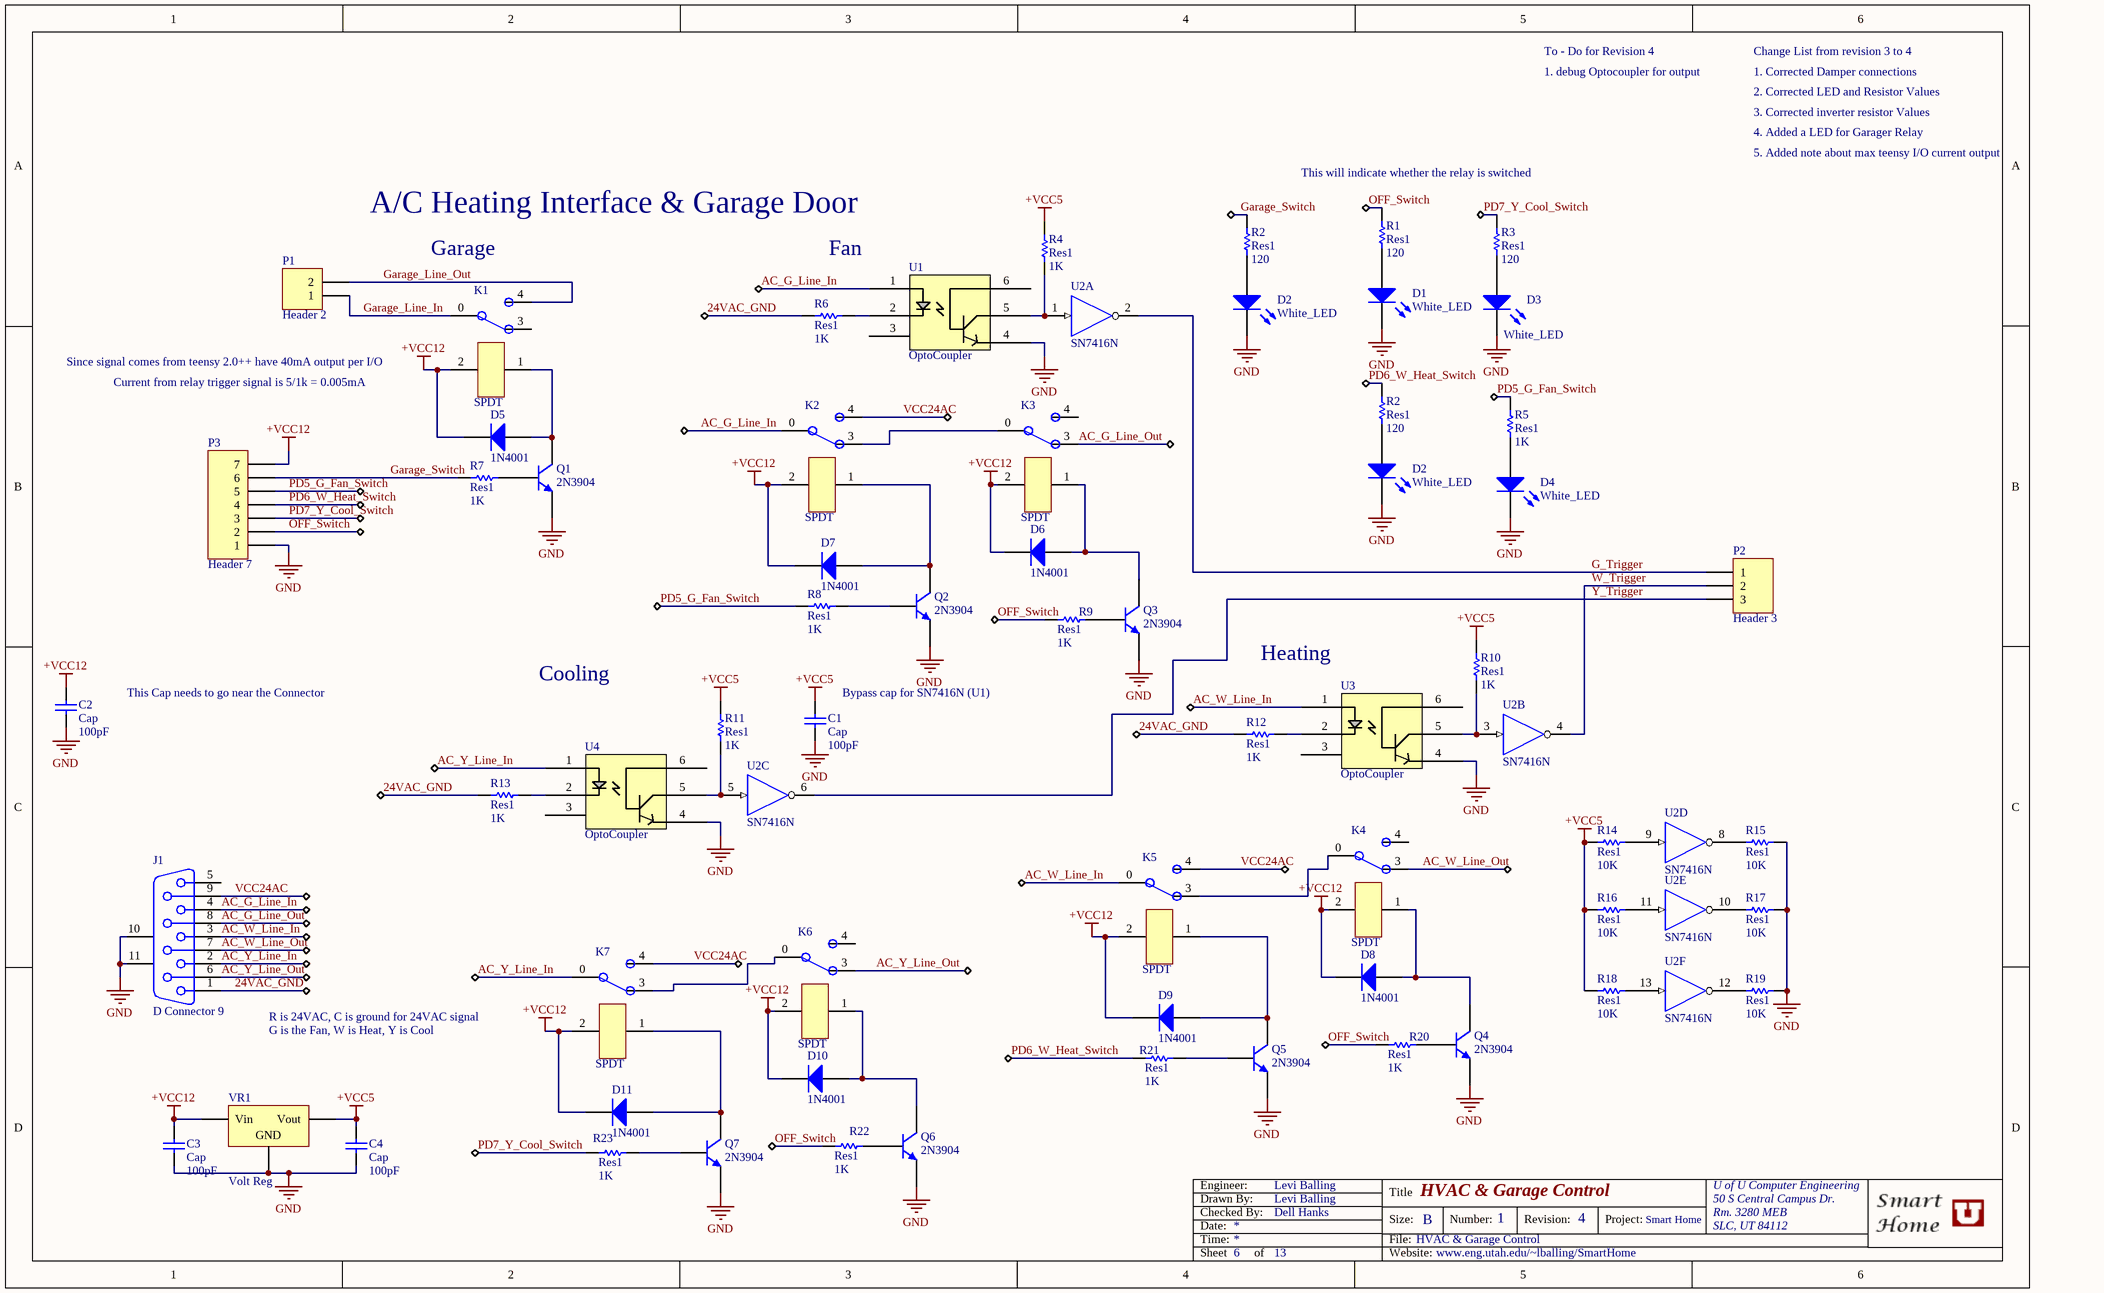
[diagram p3: HeatingAC_Garage.SchDoc]

### Parts
(Parts that share a designator on the sheet are numbered #1, #2 ... from top to bottom, then left to right.)
C1#1  Cap  value 100pF  [RAD-0.3]
C2#1  Cap  value 100pF  [RAD-0.3]
C3#1  Cap  value 100pF  [RAD-0.3]
C4#1  Cap  value 100pF  [RAD-0.3]
D1#2  White_LED  [LED-0]
D2#2  White_LED  [LED-0]
D2#3  White_LED  [LED-0]
D3#2  White_LED  [LED-0]
D4#2  White_LED  [LED-0]
D5#2  1N4001  [DO-41]
D6#2  1N4001  [DO-41]
D7#2  1N4001  [DO-41]
D8#2  1N4001  [DO-41]
D9#1  1N4001  [DO-41]
D10#1  1N4001  [DO-41]
D11#1  1N4001  [DO-41]
J1#2  D Connector 9  [DSUB1.385-2H9]
K1#2  SPDT  [Relay  SPDT]
K2#2  SPDT  [Relay  SPDT]
K3#2  SPDT  [Relay  SPDT]
K4#2  SPDT  [Relay  SPDT]
K5#2  SPDT  [Relay  SPDT]
K6#2  SPDT  [Relay  SPDT]
K7#2  SPDT  [Relay  SPDT]
P1#5  Header 2  [HDR1X2]
P2#7  Header 3  [HDR1X3]
P3#7  Header 7  [HDR1X7]
Q1#2  2N3904  [TO-92A]
Q2#2  2N3904  [TO-92A]
Q3#2  2N3904  [TO-92A]
Q4#2  2N3904  [TO-92A]
Q5#2  2N3904  [TO-92A]
Q6#2  2N3904  [TO-92A]
Q7#2  2N3904  [TO-92A]
R1#2  Res1  value 120  [AXIAL-0.3]
R2#2  Res1  value 120  [AXIAL-0.3]
R2#3  Res1  value 120  [AXIAL-0.3]
R3#2  Res1  value 120  [AXIAL-0.3]
R4#2  Res1  value 1K  [AXIAL-0.3]
R5#2  Res1  value 1K  [AXIAL-0.3]
R6#2  Res1  value 1K  [AXIAL-0.3]
R7#2  Res1  value 1K  [AXIAL-0.3]
R8#2  Res1  value 1K  [AXIAL-0.3]
R9#2  Res1  value 1K  [AXIAL-0.3]
R10#2  Res1  value 1K  [AXIAL-0.3]
R11#2  Res1  value 1K  [AXIAL-0.3]
R12#2  Res1  value 1K  [AXIAL-0.3]
R13#2  Res1  value 1K  [AXIAL-0.3]
R14#2  Res1  value 10K  [AXIAL-0.3]
R15#2  Res1  value 10K  [AXIAL-0.3]
R16#2  Res1  value 10K  [AXIAL-0.3]
R17#2  Res1  value 10K  [AXIAL-0.3]
R18#2  Res1  value 10K  [AXIAL-0.3]
R19#2  Res1  value 10K  [AXIAL-0.3]
R20#2  Res1  value 1K  [AXIAL-0.3]
R21#2  Res1  value 1K  [AXIAL-0.3]
R22#2  Res1  value 1K  [AXIAL-0.3]
R23#2  Res1  value 1K  [AXIAL-0.3]
U1#1  OptoCoupler  [DIP4]
U2#1  SN7416N  [N014]  (parts A,B,C,D,E,F of 6)
U3#1  OptoCoupler  [DIP4]
U4#1  OptoCoupler  [DIP4]
VR1#1  Volt Reg  [D2PAK_N]

### Nets
+VCC5: C1#1.2 C4#1.2 R4#2.2 R10#2.2 R11#2.2 R14#2.1 R16#2.1 R18#2.1 VR1#1.3(Vout)
+VCC12: C2#1.2 C3#1.2 D5#2.2(K) D6#2.2(K) D7#2.2(K) D8#2.2(K) D9#1.2(K) D10#1.2(K) D11#1.2(K) K1#2.2 K2#2.2 K3#2.2 K4#2.2 K5#2.2 K6#2.2 K7#2.2 P3#7.7 VR1#1.1(Vin)
GND: C1#1.1 C2#1.1 C3#1.1 C4#1.1 D1#2.2(K) D2#2.2(K) D2#3.2(K) D3#2.2(K) D4#2.2(K) J1#2.10(MH1) J1#2.11(MH2) P3#7.1 Q1#2.1(E) Q2#2.1(E) Q3#2.1(E) Q4#2.1(E) Q5#2.1(E) Q6#2.1(E) Q7#2.1(E) R15#2.2 R17#2.2 R19#2.2 U1#1.4(Emitter) U2#1.7(GND) U3#1.4(Emitter) U4#1.4(Emitter) VR1#1.2(GND)  [project net DampVCC12]
VCC: U2#1.14(VCC)
24VAC_GND: J1#2.1 R6#2.1 R12#2.1 R13#2.1
AC_G_Line_In: J1#2.4 K2#2.0 U1#1.1(Anode)
AC_G_Line_Out: J1#2.8 K3#2.3
AC_W_Line_In: J1#2.3 K5#2.0 U3#1.1(Anode)
AC_W_Line_Out: J1#2.7 K4#2.3
AC_Y_Line_In: J1#2.2 K7#2.0 U4#1.1(Anode)
AC_Y_Line_Out: J1#2.6 K6#2.3
G_Trigger: P2#7.1 U2#1.2(Y)
Garage_Line_In: K1#2.0 P1#5.1
Garage_Line_Out: K1#2.4 P1#5.2
Garage_Switch: P3#7.6 R2#2.1 R7#2.1
OFF_Switch: P3#7.2 R1#2.1 R9#2.1 R20#2.1 R22#2.1
PD5_G_Fan_Switch: P3#7.5 R5#2.1 R8#2.1
PD6_W_Heat_Switch: P3#7.4 R2#3.1 R21#2.1
PD7_Y_Cool_Switch: P3#7.3 R3#2.1 R23#2.1
VCC24AC: J1#2.9 K2#2.4 K5#2.4 K7#2.4
W_Trigger: P2#7.2 U2#1.4(Y)
Y_Trigger: P2#7.3 U2#1.6(Y)
NetD1#2_1: D1#2.1(A) R1#2.2
NetD2#2_1: D2#2.1(A) R2#2.2
NetD2#3_1: D2#3.1(A) R2#3.2
NetD3#2_1: D3#2.1(A) R3#2.2
NetD4#2_1: D4#2.1(A) R5#2.2
NetD5#2_1: D5#2.1(A) K1#2.1 Q1#2.3(C)
NetD6#2_1: D6#2.1(A) K3#2.1 Q3#2.3(C)
NetD7#2_1: D7#2.1(A) K2#2.1 Q2#2.3(C)
NetD8#2_1: D8#2.1(A) K4#2.1 Q4#2.3(C)
NetD9#1_1: D9#1.1(A) K5#2.1 Q5#2.3(C)
NetD10#1_1: D10#1.1(A) K6#2.1 Q6#2.3(C)
NetD11#1_1: D11#1.1(A) K7#2.1 Q7#2.3(C)
NetK2#2_3: K2#2.3 K3#2.0
NetK4#2_0: K4#2.0 K5#2.3
NetK6#2_0: K6#2.0 K7#2.3
NetQ1#2_2: Q1#2.2(B) R7#2.2
NetQ2#2_2: Q2#2.2(B) R8#2.2
NetQ3#2_2: Q3#2.2(B) R9#2.2
NetQ4#2_2: Q4#2.2(B) R20#2.2
NetQ5#2_2: Q5#2.2(B) R21#2.2
NetQ6#2_2: Q6#2.2(B) R22#2.2
NetQ7#2_2: Q7#2.2(B) R23#2.2
NetR4#2_1: R4#2.1 U1#1.5(Collector) U2#1.1(A)
NetR6#2_2: R6#2.2 U1#1.2(Cathode)
NetR10#2_1: R10#2.1 U2#1.3(A) U3#1.5(Collector)
NetR11#2_1: R11#2.1 U2#1.5(A) U4#1.5(Collector)
NetR12#2_2: R12#2.2 U3#1.2(Cathode)
NetR13#2_2: R13#2.2 U4#1.2(Cathode)
NetR14#2_2: R14#2.2 U2#1.9(A)
NetR15#2_1: R15#2.1 U2#1.8(Y)
NetR16#2_2: R16#2.2 U2#1.11(A)
NetR17#2_1: R17#2.1 U2#1.10(Y)
NetR18#2_2: R18#2.2 U2#1.13(A)
NetR19#2_1: R19#2.1 U2#1.12(Y)

Not connected (* = marked no-connect by the designer): J1#2 5; K1#2 3; K3#2 4; K4#2 4; K6#2 4; U1#1 3 6(Base); U3#1 3 6(Base); U4#1 3 6(Base)

### Notes on the sheet
- To - Do for Revision 4
- 1. debug Optocoupler for output
- Change List from revision 3 to 4
- 1. Corrected Damper connections
- 2. Corrected LED and Resistor Values
- 3. Corrected inverter resistor Values
- 4. Added a LED for Garager Relay
- 5. Added note about max teensy I/O current output
- A/C Heating Interface & Garage Door
- This will indicate whether the relay is switched
- (near K1#2) Garage
- Fan
- Since signal comes from teensy 2.0++ have 40mA output per I/O
- Current from relay trigger signal is 5/1k = 0.005mA
- This Cap needs to go near the Connector
- Cooling
- (near C1#1) Bypass cap for SN7416N (U1)
- (near U3#1) Heating
- R is 24VAC, C is ground for 24VAC signal
- G is the Fan, W is Heat, Y is Cool
- Date:
- Time:
- Engineer:
- Drawn By:
- Checked By:
- Title
- Size:
- File:
- B
- Number:
- Revision:
- Project:
- Sheet
- of
- Website:

### Library data of the parts
C1#1 C2#1 C3#1 C4#1 = Cap: Capacitor; Published: 8-Jun-2000; LatestRevisionDate: 17-Jul-2002; LatestRevisionNote: Re-released for DXP Platform.; PackageReference: RAD-0.3; Publisher: Altium Limited; PackageDescription: Radial Cap, Thru-Hole; 2 Leads; 0.3 in Pin Spacing
D1#2 D2#2 D2#3 D3#2 D4#2 = LED0: Typical INFRARED GaAs LED; Published: 8-Jun-2000; LatestRevisionDate: 08-Jul-2005; LatestRevisionNote: Mech Layer 1 removed.; PackageReference: LED-0; Publisher: Altium Limited; PackageDescription: LED; 2 Leads
D5#2 D6#2 D7#2 D8#2 D9#1 D10#1 D11#1 = 1N4001: 1.0 Ampere General Purpose Rectifier; Published: 8-Jun-2000; LatestRevisionDate: 17-Jul-2002; LatestRevisionNote: Re-released for DXP Platform.; DatasheetDocument: 1998; PackageDocument: Aug-1999; PackageReference: DO-41; Publisher: Altium Limited; Code_JEDEC: DO-204-AL; ComponentLink1Description: Manufacturer Link; ComponentLink1URL: http://www.fairchildsemi.com/; ComponentLink2Description: Pinout Specification; ComponentLink2URL: http://www.fairchildsemi.com/ds/1N%2F1N4001.pdf
J1#2 = D Connector 9: Receptacle Assembly, 9 Position, Right Angle; PackageDocument: O; Positions: 9; Published: 15-Jun-2001; LatestRevisionDate: 17-Jul-2002; LatestRevisionNote: Re-released for DXP Platform.; DatasheetDocument: 1-Sep-1999; PackageReference: 788750; Publisher: Altium Limited; Orientation: Right Angle; Gender: Receptacle
K1#2 K2#2 K3#2 K4#2 K5#2 K6#2 K7#2 = SPDT: as K1#1 on sheet DamperSection; Price: 0.64
P1#5 = Header 2: Header, 2-Pin; LatestRevisionDate: 17-Jul-2002; LatestRevisionNote: Re-released for DXP Platform.; Publisher: Altium Limited
P2#7 = Header 3: Header, 3-Pin; LatestRevisionDate: 17-Jul-2002; LatestRevisionNote: Re-released for DXP Platform.; Publisher: Altium Limited
P3#7 = Header 7: Header, 7-Pin; LatestRevisionDate: 17-Jul-2002; LatestRevisionNote: Re-released for DXP Platform.; Publisher: Altium Limited
Q1#2 Q2#2 Q3#2 Q4#2 Q5#2 Q6#2 Q7#2 = 2N3904: NPN General Purpose Amplifier; Published: 8-Jun-2000; LatestRevisionDate: 15-Jan-2003; LatestRevisionNote: PCB Footprint 'BCY-W3/D4.7' replaced; DatasheetVersion: 1997; PackageVersion: Sep-1998; PackageReference: TO-92A; Publisher: Altium Limited; PackageDescription: TO, Flat Index; 3 In-Line, Axial Leads; Body Dia. 4.5mm; Leads 0.51 x 0.48 mm (max); ComponentLink1URL: http://www.fairchildsemi.com/; ComponentLink2Description: Datasheet; ComponentLink2URL: http://www.fairchildsemi.com/ds/2N%2F2N3904.pdf; ComponentLink1Description: Manufacturer Link
R1#2 R2#2 R2#3 R3#2 R4#2 R5#2 R6#2 R7#2 R8#2 R9#2 R10#2 R11#2 R12#2 R13#2 R14#2 R15#2 R16#2 R17#2 R18#2 R19#2 R20#2 R21#2 R22#2 R23#2 = Res1: Resistor; Published: 8-Jun-2000; LatestRevisionDate: 17-Jul-2002; LatestRevisionNote: Re-released for DXP Platform.; PackageReference: AXIAL-0.3; Publisher: Altium Limited; PackageDescription: Axial Device, Thru-Hole; 2 Leads; 0.3 in Pin Spacing
U1#1 U3#1 U4#1 = OptoCoupler: Vendor: Taydaelectronics; Price: 0.3
U2#1 = SN7416N: Hex Inverter Buffer / Driver with High-Voltage Outputs; Published: 8-Jun-2000; LatestRevisionDate: 04-Mar-2005; LatestRevisionNote: Stylized 3D Model Added.; DatasheetVersion: Mar-1988; PackageVersion: Oct-1995; PackageReference: N014; Publisher: Altium Limited; PackageDescription: DIP; 14 Leads; Row Spacing 7.62 mm; Pitch 2.54 mm; ComponentLink1URL: http://www.ti.com/; ComponentLink2Description: Datasheet; ComponentLink2URL: http://www-s.ti.com/sc/ds/sn5416.pdf; ComponentLink3Description: Packaging Specification; ComponentLink3URL: http://focus.ti.com/lit/ml/mpdi002c/mpdi002c.pdf; ComponentLink1Description: Manufacturer Link
VR1#1 = Volt Reg: Voltage Regulator; Published: 24-Mar-1999; LatestRevisionDate: 29-May-2009; LatestRevisionNote: IPC-7351 Footprint Added.; PackageReference: D2PAK; Publisher: Altium Limited; PackageDescription: 3-Pin Transistor Outline Package 2.54 mm Pitch, 15.1 mm Lead Span

## Sheet MainController.SchDoc: Main Controller
size B; Date: 7/13/2012; ApprovedBy: Levi Balling; CheckedBy: Dell Hanks; Author: Levi Balling; CompanyName: Smart Home; DrawnBy: Levi Balling; Engineer: Levi Balling; Organization: U of U Computer Engineering; Address1: 50 S Central Campus Dr.; Address2: Rm. 3280 MEB; Address3: SLC, UT 84112; DocumentNumber: 1; Revision: 2; SheetNumber: 4; SheetTotal: 13; Project: Smart Home; Website: www.eng.utah.edu/~lballing/SmartHome; CurrentDate: 7/13/2012; DocumentName: Main Controller; ProjectName: Smart Home
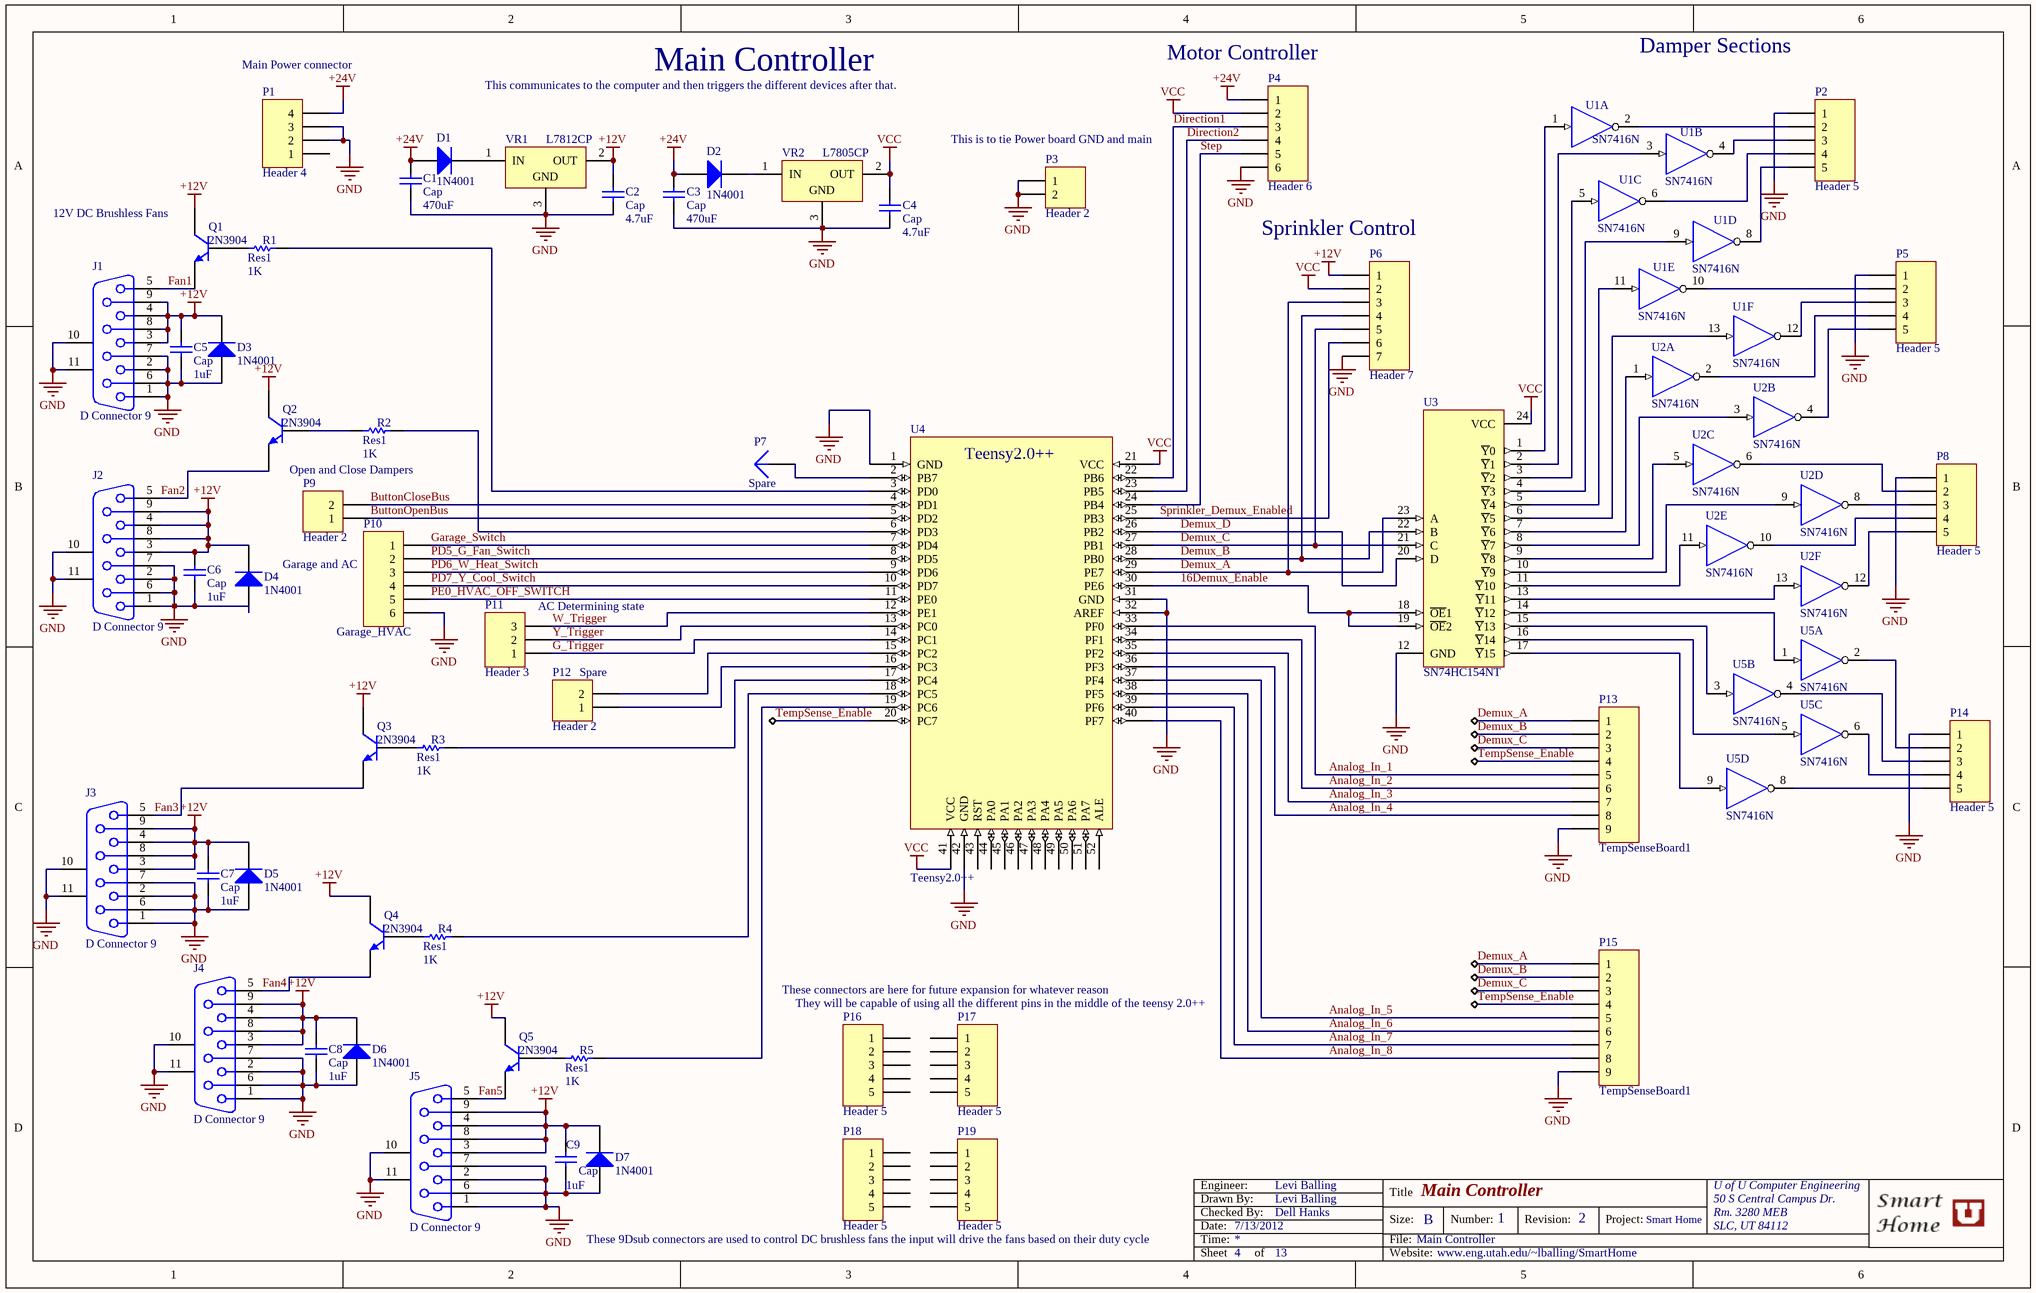
[diagram p4: MainController.SchDoc]

### Parts
(Parts that share a designator on the sheet are numbered #1, #2 ... from top to bottom, then left to right.)
C1#2  Cap  value 470uF  [RAD-0.3]
C2#2  Cap  value 4.7uF  [RAD-0.3]
C3#2  Cap  value 470uF  [RAD-0.3]
C4#2  Cap  value 4.7uF  [RAD-0.3]
C5#1  Cap  value 1uF  [RAD-0.3]
C6#1  Cap  value 1uF  [RAD-0.3]
C7#1  Cap  value 1uF  [RAD-0.3]
C8#1  Cap  value 1uF  [RAD-0.3]
C9#1  Cap  value 1uF  [RAD-0.3]
D1#3  1N4001  [DO-41]
D2#4  1N4001  [DO-41]
D3#3  1N4001  [DO-41]
D4#3  1N4001  [DO-41]
D5#3  1N4001  [DO-41]
D6#3  1N4001  [DO-41]
D7#3  1N4001  [DO-41]
J1#3  D Connector 9  [DSUB1.385-2H9]
J2#2  D Connector 9  [DSUB1.385-2H9]
J3#2  D Connector 9  [DSUB1.385-2H9]
J4#2  D Connector 9  [DSUB1.385-2H9]
J5  D Connector 9  [DSUB1.385-2H9]
P1#6  Header 4  [MainPowerConnector]
P2#8  Header 5  [HDR1X5]
P3#8  Header 2  [HDR1X2]
P4#6  Header 6  [HDR1X6]
P5#6  Header 5  [HDR1X5]
P6#3  Header 7  [HDR1X7]
P7#2  Spare  [PIN1]
P8#1  Header 5  [HDR1X5]
P9#1  Header 2  [HDR1X2]
P10#2  Garage_HVAC  [HDR1X6]
P11#1  Header 3  [HDR1X3]
P12#1  Header 2  [HDR1X2]
P13#2  TempSenseBoard1  [HDR1X9]
P14#2  Header 5  [HDR1X5]
P15#1  TempSenseBoard1  [HDR1X9]
P16#1  Header 5  [HDR1X5]
P17#1  Header 5  [HDR1X5]
P18#1  Header 5  [HDR1X5]
P19#1  Header 5  [HDR1X5]
Q1#3  2N3904  [2N3904]
Q2#3  2N3904  [2N3904]
Q3#3  2N3904  [2N3904]
Q4#3  2N3904  [2N3904]
Q5#3  2N3904  [2N3904]
R1#3  Res1  value 1K  [AXIAL-0.3]
R2#4  Res1  value 1K  [AXIAL-0.3]
R3#3  Res1  value 1K  [AXIAL-0.3]
R4#3  Res1  value 1K  [AXIAL-0.3]
R5#3  Res1  value 1K  [AXIAL-0.3]
U1#2  SN7416N  [N014]  (parts A,B,C,D,E,F of 6)
U2#2  SN7416N  [N014]  (parts A,B,C,D,E,F of 6)
U3#2  SN74HC154NT  [NT024D]
U4#2  Teensy2.0++  [Teensy2.0++]
U5#1  SN7416N  [N014]  (parts A,B,C,D of 6)
VR1#2  L7812CP  [ISOWATT220AB]
VR2#1  L7805CP  [ISOWATT220AB]

### Nets
+12V: C2#2.1 C5#1.2 C6#1.2 C7#1.2 C8#1.2 C9#1.2 D3#3.2(K) D4#3.2(K) D5#3.2(K) D6#3.2(K) D7#3.2(K) J1#3.3 J1#3.4 J1#3.8 J1#3.9 J2#2.3 J2#2.4 J2#2.8 J2#2.9 J3#2.3 J3#2.4 J3#2.8 J3#2.9 J4#2.3 J4#2.4 J4#2.8 J4#2.9 J5.3 J5.4 J5.8 J5.9 P6#3.1 Q1#3.3(C) Q2#3.3(C) Q3#3.3(C) Q4#3.3(C) Q5#3.3(C) VR1#2.2(OUT)  [project net VCC12]
+24V: C1#2.1 C3#2.1 D1#3.1(A) D2#4.1(A) P1#6.4 P4#6.1
GND: C1#2.2 C2#2.2 C3#2.2 C4#2.2 C5#1.1 C6#1.1 C7#1.1 C8#1.1 C9#1.1 D3#3.1(A) D4#3.1(A) D5#3.1(A) D6#3.1(A) D7#3.1(A) J1#3.1 J1#3.2 J1#3.6 J1#3.7 J1#3.10(MH1) J1#3.11(MH2) J2#2.1 J2#2.2 J2#2.6 J2#2.7 J2#2.10(MH1) J2#2.11(MH2) J3#2.1 J3#2.2 J3#2.6 J3#2.7 J3#2.10(MH1) J3#2.11(MH2) J4#2.1 J4#2.2 J4#2.6 J4#2.7 J4#2.10(MH1) J4#2.11(MH2) J5.1 J5.2 J5.6 J5.7 J5.10(MH1) J5.11(MH2) P1#6.2 P1#6.3 P2#8.1 P3#8.1 P3#8.2 P4#6.6 P5#6.1 P6#3.7 P8#1.1 P10#2.6 P13#2.9 P14#2.1 P15#1.9 U1#2.7(GND) U2#2.7(GND) U3#2.12(GND) U4#2.1(GND) U4#2.31(GND) U4#2.32(AREF) U4#2.42(GND) U5#1.7(GND) VR1#2.3(GND) VR2#1.3(GND)  [project net DampVCC12]
VCC: C4#2.1 P4#6.2 P6#3.2 U1#2.14(VCC) U2#2.14(VCC) U3#2.24(VCC) U4#2.21(VCC) U4#2.41(VCC) U5#1.14(VCC5) VR2#1.2(OUT)
16Demux_Enable: U3#2.18(~{OE}1) U3#2.19(~{OE}2) U4#2.30(PE6)
Analog_In_1: P13#2.5 U4#2.33(PF0)
Analog_In_2: P13#2.6 U4#2.34(PF1)
Analog_In_3: P13#2.7 U4#2.35(PF2)
Analog_In_4: P13#2.8 U4#2.36(PF3)
Analog_In_5: P15#1.5 U4#2.37(PF4)
Analog_In_6: P15#1.6 U4#2.38(PF5)
Analog_In_7: P15#1.7 U4#2.39(PF6)
Analog_In_8: P15#1.8 U4#2.40(PF7)
ButtonCloseBus: P9#1.2 U4#2.4(PD1)
ButtonOpenBus: P9#1.1 U4#2.5(PD2)
Demux_A: P6#3.3 P13#2.1 P15#1.1 U3#2.23(A) U4#2.29(PE7)
Demux_B: P6#3.4 P13#2.2 P15#1.2 U3#2.22(B) U4#2.28(PB0)
Demux_C: P6#3.5 P13#2.3 P15#1.3 U3#2.21(C) U4#2.27(PB1)
Demux_D: U3#2.20(D) U4#2.26(PB2)
Direction1: P4#6.3 U4#2.22(PB6)
Direction2: P4#6.4 U4#2.23(PB5)
Fan1: J1#3.5 Q1#3.1(E)
Fan2: J2#2.5 Q2#3.1(E)
Fan3: J3#2.5 Q3#3.1(E)
Fan4: J4#2.5 Q4#3.1(E)
Fan5: J5.5 Q5#3.1(E)
G_Trigger: P11#1.1 U4#2.14(PC1)
Garage_Switch: P10#2.1 U4#2.7(PD4)
PD5_G_Fan_Switch: P10#2.2 U4#2.8(PD5)
PD6_W_Heat_Switch: P10#2.3 U4#2.9(PD6)
PD7_Y_Cool_Switch: P10#2.4 U4#2.10(PD7)
PE0_HVAC_OFF_SWITCH: P10#2.5 U4#2.11(PE0)
Sprinkler_Demux_Enabled: P6#3.6 U4#2.25(PB3)
Step: P4#6.5 U4#2.24(PB4)
TempSense_Enable: P13#2.4 P15#1.4 U4#2.20(PC7)
W_Trigger: P11#1.3 U4#2.12(PE1)
Y_Trigger: P11#1.2 U4#2.13(PC0)
NetD1#3_2: D1#3.2(K) VR1#2.1(IN)
NetD2#4_2: D2#4.2(K) VR2#1.1(IN)
NetP2#8_2: P2#8.2 U1#2.2(Y)
NetP2#8_3: P2#8.3 U1#2.4(Y)
NetP2#8_4: P2#8.4 U1#2.6(Y)
NetP2#8_5: P2#8.5 U1#2.8(Y)
NetP5#6_2: P5#6.2 U1#2.10(Y)
NetP5#6_3: P5#6.3 U1#2.12(Y)
NetP5#6_4: P5#6.4 U2#2.2(Y)
NetP5#6_5: P5#6.5 U2#2.4(Y)
NetP7#2_1: P7#2.1 U4#2.2(PB7)
NetP8#1_2: P8#1.2 U2#2.6(Y)
NetP8#1_3: P8#1.3 U2#2.8(Y)
NetP8#1_4: P8#1.4 U2#2.10(Y)
NetP8#1_5: P8#1.5 U2#2.12(Y)
NetP12#1_1: P12#1.1 U4#2.16(PC3)
NetP12#1_2: P12#1.2 U4#2.15(PC2)
NetP14#2_2: P14#2.2 U5#1.2(Y)
NetP14#2_3: P14#2.3 U5#1.4(Y)
NetP14#2_4: P14#2.4 U5#1.6(Y)
NetP14#2_5: P14#2.5 U5#1.8(Y)
NetQ1#3_2: Q1#3.2(B) R1#3.1
NetQ2#3_2: Q2#3.2(B) R2#4.1
NetQ3#3_2: Q3#3.2(B) R3#3.1
NetQ4#3_2: Q4#3.2(B) R4#3.1
NetQ5#3_2: Q5#3.2(B) R5#3.1
NetR1#3_2: R1#3.2 U4#2.3(PD0)
NetR2#4_2: R2#4.2 U4#2.6(PD3)
NetR3#3_2: R3#3.2 U4#2.17(PC4)
NetR4#3_2: R4#3.2 U4#2.18(PC5)
NetR5#3_2: R5#3.2 U4#2.19(PC6)
NetU1#2_1: U1#2.1(A) U3#2.1(~{Y}0)
NetU1#2_3: U1#2.3(A) U3#2.2(~{Y}1)
NetU1#2_5: U1#2.5(A) U3#2.3(~{Y}2)
NetU1#2_9: U1#2.9(A) U3#2.4(~{Y}3)
NetU1#2_11: U1#2.11(A) U3#2.5(~{Y}4)
NetU1#2_13: U1#2.13(A) U3#2.6(~{Y}5)
NetU2#2_1: U2#2.1(A) U3#2.7(~{Y}6)
NetU2#2_3: U2#2.3(A) U3#2.8(~{Y}7)
NetU2#2_5: U2#2.5(A) U3#2.9(~{Y}8)
NetU2#2_9: U2#2.9(A) U3#2.10(~{Y}9)
NetU2#2_11: U2#2.11(A) U3#2.11(~{Y}10)
NetU2#2_13: U2#2.13(A) U3#2.13(~{Y}11)
NetU3#2_14: U3#2.14(~{Y}12) U5#1.1(A)
NetU3#2_15: U3#2.15(~{Y}13) U5#1.3(A)
NetU3#2_16: U3#2.16(~{Y}14) U5#1.5(A)
NetU3#2_17: U3#2.17(~{Y}15) U5#1.9(A)

Not connected (* = marked no-connect by the designer): P1#6 1; P16#1 1 2 3 4 5; P17#1 1 2 3 4 5; P18#1 1 2 3 4 5; P19#1 1 2 3 4 5; U4#2 43(RST) 44(PA0) 45(PA1) 46(PA2) 47(PA3) 48(PA4) 49(PA5) 50(PA6) 51(PA7) 52(ALE)

### Notes on the sheet
- (near P1#6) Main Power connector
- This communicates to the computer and then triggers the different devices after that.
- (near P4#6) Motor Controller
- Damper Sections
- (near P3#8) This is to tie Power board GND and main
- (near Q1#3) 12V DC Brushless Fans
- Sprinkler Control
- Open and Close Dampers
- Garage and AC
- (near P11#1) AC Determining state
- (near P12#1) Spare
- These connectors are here for future expansion for whatever reason
- They will be capable of using all the different pins in the middle of the teensy 2.0++
- These 9Dsub connectors are used to control DC brushless fans the input will drive the fans based on their duty cycle
- Date:
- Time:
- Engineer:
- Drawn By:
- Checked By:
- Title
- Size:
- File:
- B
- Number:
- Revision:
- Project:
- Sheet
- of
- Website:

### Library data of the parts
C1#2 C2#2 C3#2 C4#2 C5#1 C6#1 C7#1 C8#1 C9#1 = Cap: Capacitor; Vendor: Taydaelectronics; Published: 8-Jun-2000; LatestRevisionDate: 17-Jul-2002; LatestRevisionNote: Re-released for DXP Platform.; PackageReference: RAD-0.3; Publisher: Altium Limited; PackageDescription: Radial Cap, Thru-Hole; 2 Leads; 0.3 in Pin Spacing; Price: 0.03
D1#3 D2#4 = Diode 1N4001: 1 Amp General Purpose Rectifier; Vendor: Taydaelectronics; Published: 8-Jun-2000; LatestRevisionDate: 17-Jul-2002; LatestRevisionNote: Re-released for DXP Platform.; DatasheetVersion: 1998; PackageVersion: Aug-1999; PackageReference: DO-41; Publisher: Altium Limited; PackageDescription: Diode, Axial; Body 5.2 x 2.7 mm (LxDia. max), Lead Dia. 0.86 mm (max); Code_JEDEC: DO-204-AL; ComponentLink1URL: http://www.fairchildsemi.com/; ComponentLink2Description: Datasheet; ComponentLink2URL: http://www.fairchildsemi.com/ds/1N%2F1N4001.pdf; Price: 0.01; Value: 1N4001
D3#3 D4#3 D5#3 D6#3 D7#3 = 1N4001: as D1#1 on sheet DamperSection; Published: 8-Jun-2000; LatestRevisionDate: 17-Jul-2002; LatestRevisionNote: Re-released for DXP Platform.; DatasheetDocument: 1998; PackageDocument: Aug-1999; PackageReference: DO-41; Publisher: Altium Limited; Code_JEDEC: DO-204-AL; ComponentLink1Description: Manufacturer Link; ComponentLink1URL: http://www.fairchildsemi.com/; ComponentLink2Description: Pinout Specification; ComponentLink2URL: http://www.fairchildsemi.com/ds/1N%2F1N4001.pdf; Price: 0.01; Value: 1N4001
J1#3 J2#2 J3#2 J4#2 J5 = D Connector 9: as J1#1 on sheet DamperSection; Published: 15-Jun-2001; LatestRevisionDate: 17-Jul-2002; LatestRevisionNote: Re-released for DXP Platform.; DatasheetDocument: 1-Sep-1999; PackageReference: 788750; Publisher: Altium Limited; Orientation: Right Angle; Gender: Receptacle; Price: 0.48; Value: D Connector 9
P1#6 = Header 4: Header, 4-Pin; Vendor: Taydaelectronics; LatestRevisionDate: 17-Jul-2002; LatestRevisionNote: Re-released for DXP Platform.; Publisher: Altium Limited; Price: 0.04; Value: Header 4
P2#8 P5#6 P8#1 P14#2 P16#1 P17#1 P18#1 P19#1 = Header 5: Header, 5-Pin; Vendor: Taydaelectronics; LatestRevisionDate: 17-Jul-2002; LatestRevisionNote: Re-released for DXP Platform.; Publisher: Altium Limited; Price: 0.05; Value: Header 5
P3#8 P9#1 P12#1 = Header 2: Header, 2-Pin; Vendor: Taydaelectronics; LatestRevisionDate: 17-Jul-2002; LatestRevisionNote: Re-released for DXP Platform.; Publisher: Altium Limited; Price: 0.02; Value: Header 2
P4#6 P10#2 = Header 6: Header, 6-Pin; Vendor: Taydaelectronics; LatestRevisionDate: 17-Jul-2002; LatestRevisionNote: Re-released for DXP Platform.; Publisher: Altium Limited; Price: 0.06; Value: Header 6
P6#3 = Header 7: Header, 7-Pin; Vendor: Taydaelectronics; LatestRevisionDate: 17-Jul-2002; LatestRevisionNote: Re-released for DXP Platform.; Publisher: Altium Limited; Price: 0.07; Value: Header 7
P7#2 = Plug: Vendor: Taydaelectronics; LatestRevisionDate: 17-Jul-2002; LatestRevisionNote: Re-released for DXP Platform.; Publisher: Altium Limited; Price: 0.00; Value: Plug
P11#1 = Header 3: Header, 3-Pin; Vendor: Taydaelectronics; LatestRevisionDate: 17-Jul-2002; LatestRevisionNote: Re-released for DXP Platform.; Publisher: Altium Limited; Price: 0.03; Value: Header 3
P13#2 P15#1 = Header 9: Header, 9-Pin; Vendor: Taydaelectronics; LatestRevisionDate: 17-Jul-2002; LatestRevisionNote: Re-released for DXP Platform.; Publisher: Altium Limited; Price: 0.09; Value: Header 9
Q1#3 Q2#3 Q3#3 Q4#3 Q5#3 = 2N3904: as Q1#1 on sheet DamperSection; Published: 8-Jun-2000; LatestRevisionDate: 15-Jan-2003; LatestRevisionNote: PCB Footprint 'BCY-W3/D4.7' replaced; DatasheetVersion: 1997; PackageVersion: Sep-1998; PackageReference: TO-92A; Publisher: Altium Limited; PackageDescription: TO, Flat Index; 3 In-Line, Axial Leads; Body Dia. 4.5mm; Leads 0.51 x 0.48 mm (max); ComponentLink1URL: http://www.fairchildsemi.com/; ComponentLink2Description: Datasheet; ComponentLink2URL: http://www.fairchildsemi.com/ds/2N%2F2N3904.pdf; Price: 0.01; Value: 2N3904
R1#3 R2#4 R3#3 R4#3 R5#3 = Res1: Resistor; Vendor: Taydaelectronics; Published: 8-Jun-2000; LatestRevisionDate: 17-Jul-2002; LatestRevisionNote: Re-released for DXP Platform.; PackageReference: AXIAL-0.3; Publisher: Altium Limited; PackageDescription: Axial Device, Thru-Hole; 2 Leads; 0.3 in Pin Spacing; Price: 0.01
U1#2 U2#2 U5#1 = SN7416N: Hex Inverter Buffer / Driver with High-Voltage Outputs; Vendor: Taydaelectronics; Published: 8-Jun-2000; LatestRevisionDate: 04-Mar-2005; LatestRevisionNote: Stylized 3D Model Added.; DatasheetVersion: Mar-1988; PackageVersion: Oct-1995; PackageReference: N014; Publisher: Altium Limited; PackageDescription: DIP; 14 Leads; Row Spacing 7.62 mm; Pitch 2.54 mm; ComponentLink1URL: http://www.ti.com/; ComponentLink2Description: Datasheet; ComponentLink2URL: http://www-s.ti.com/sc/ds/sn5416.pdf; ComponentLink3Description: Packaging Specification; ComponentLink3URL: http://focus.ti.com/lit/ml/mpdi002c/mpdi002c.pdf; Price: 0.18; Value: SN7416N
U3#2 = SN74HC154NT: 4-Line to 16-Line Decoder / Demultiplexer; ComponentAvailability: Obsolete; Vendor: Digi-Key; Published: 8-Jun-2000; LatestRevisionDate: 04-Mar-2005; LatestRevisionNote: Stylized 3D Model Added.; DatasheetVersion: Sep-1987; PackageVersion: Oct-1994; PackageReference: NT024D; Publisher: Altium Limited; PackageDescription: DIP; 24 Leads; Row Spacing 7.62 mm; Pitch 2.54 mm; Code_JEDEC: MS-001-AF; ComponentLink1URL: http://www.ti.com/; ComponentLink2Description: Discontinuation Notice; ComponentLink2URL: http://focus.ti.com/docs/prod/folders/print/sn74hc154.html; Price: 3.70; Value: SN74HC154NT
U4#2 = Teensy2.0++: The teensy 2.0 from www.PJRC.com; Vendor: PJRC; Vendor: Taydaelectronics; Price: 24.0; Value: Teensy2.0++
VR1#2 VR2#1 = L7805CP: Positive Voltage Regulator; Note: Tab is connected to pin 3 (GND).; Vendor: Taydaelectronics; Published: 24-Aug-2001; LatestRevisionDate: 17-Jul-2002; LatestRevisionNote: Re-released for DXP Platform.; DatasheetVersion: Dec-1998; PackageVersion: Jul-1998; PackageReference: ISOWATT220AB; Publisher: Altium Limited; PackageDescription: TO, Thru-Hole, Vertical, Heatsink Mounted; 3 In-Line Leads; Pitch 2.54 mm; Pin sequence 1, 3, 2; ComponentLink1URL: http://www.st.com/; Price: 0.24
  VR1#2: Value: L7812CP
  VR2#1: Value: L7805CP